# EAGLE board EEZ DIB MCU r1B3 (EAGLE 7.2.0), part 1 of 2
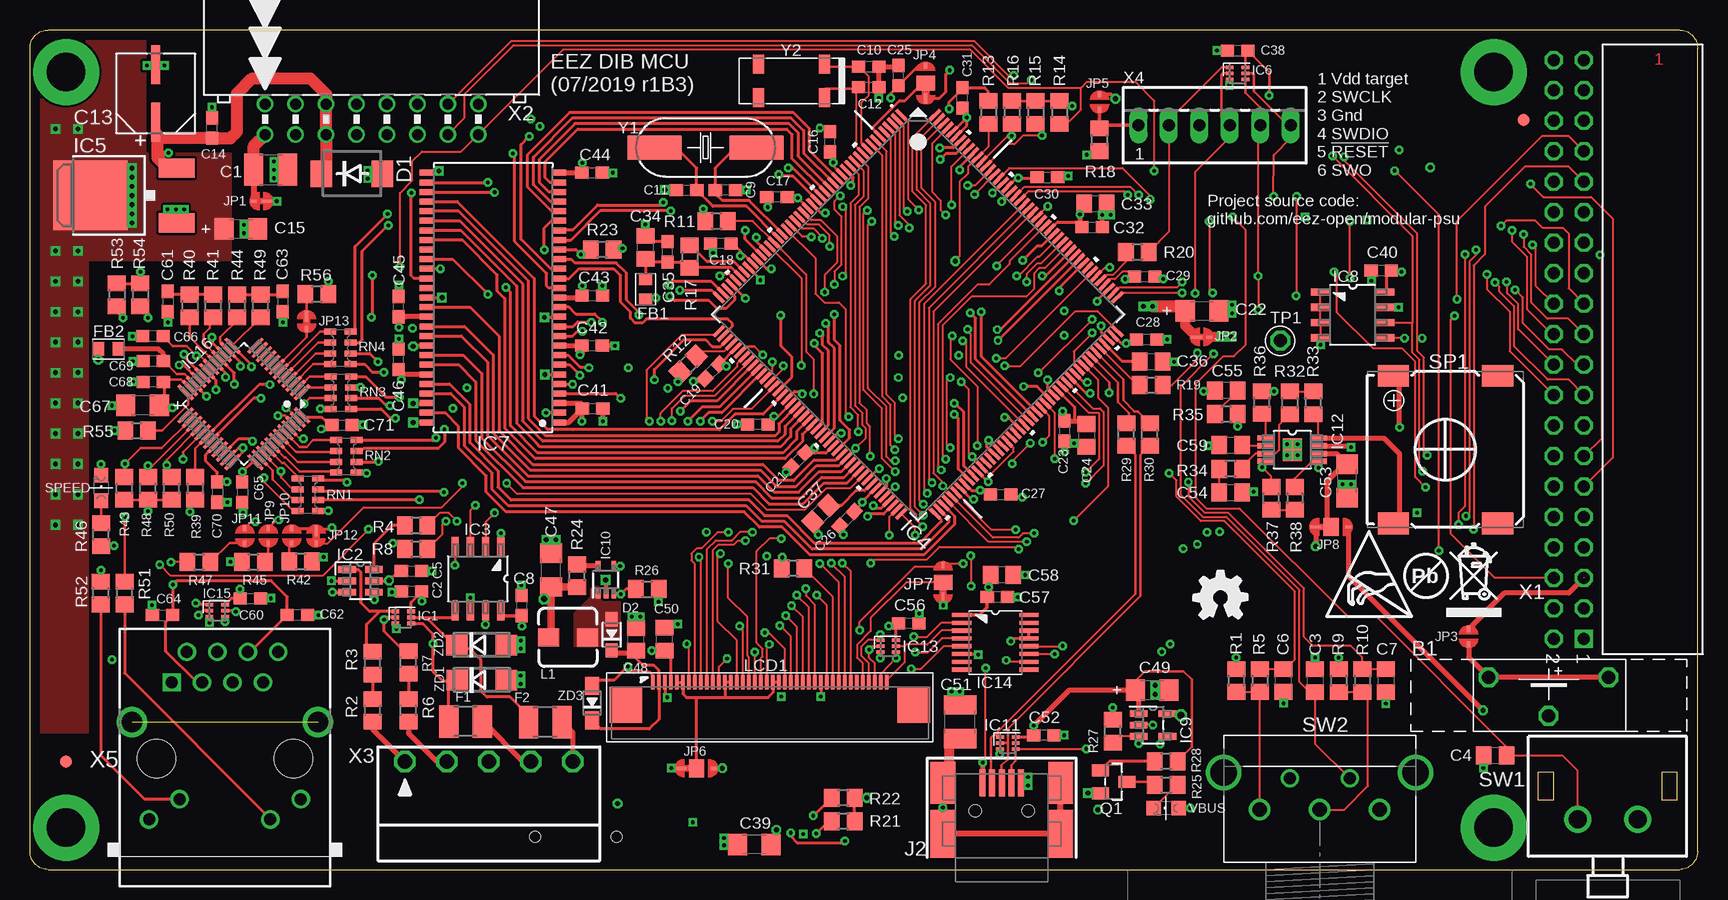
[diagram p5: board, top side]
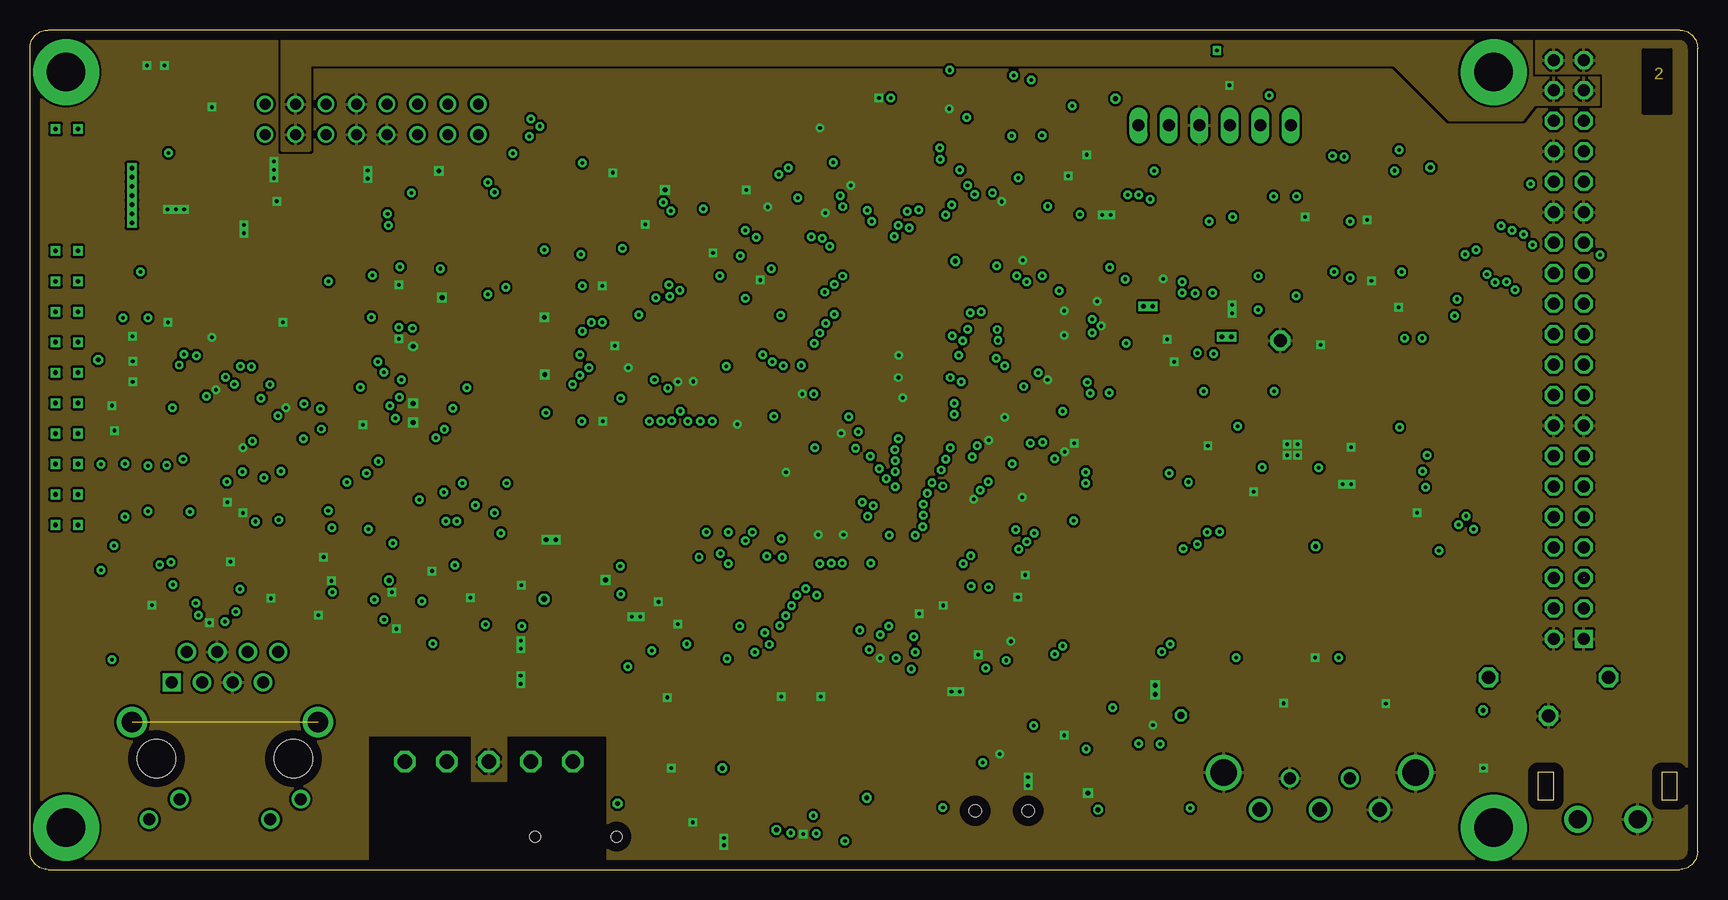
[diagram p6: board, inner layer Gnd]
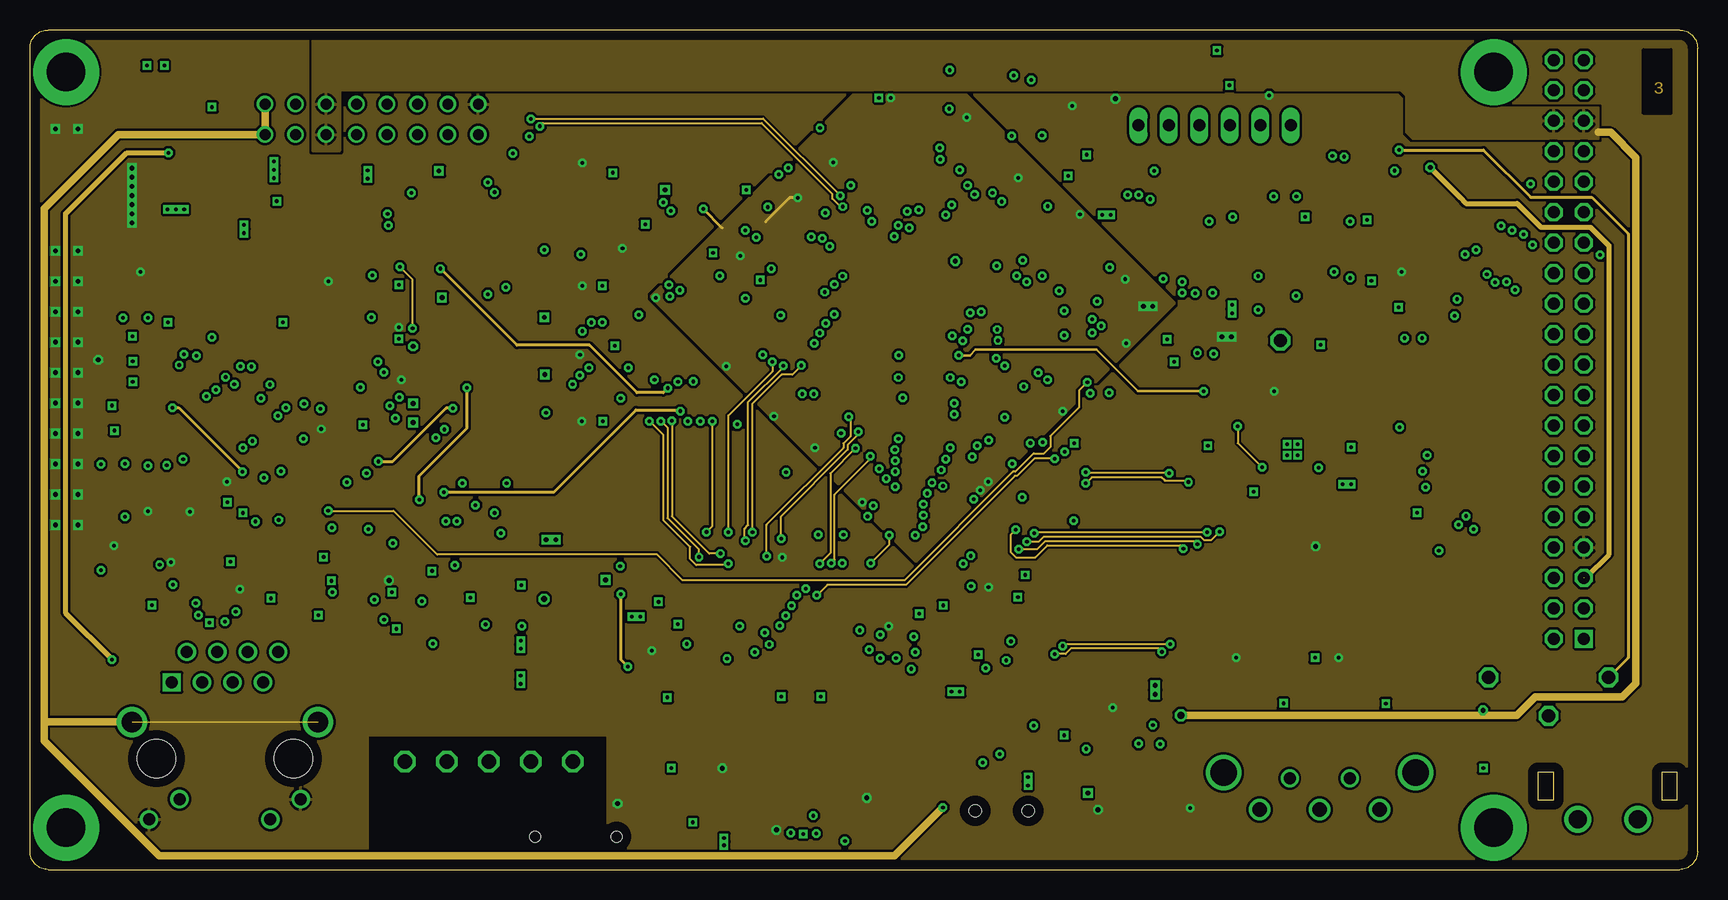
[diagram p7: board, inner layer Power]
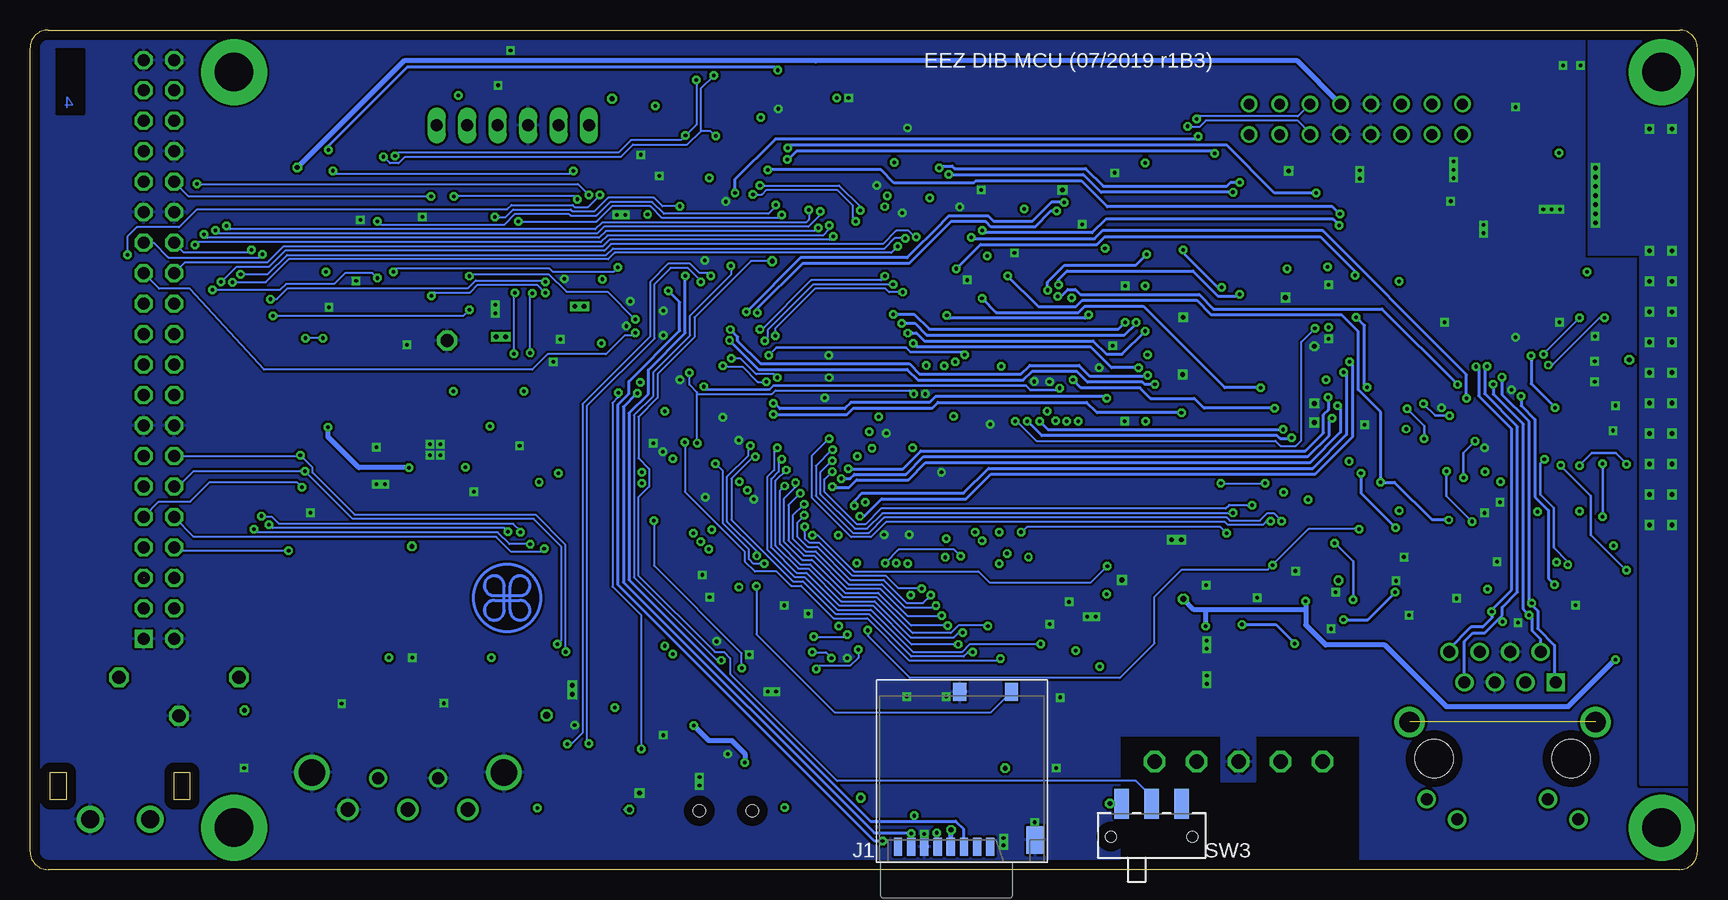
[diagram p8: board, bottom side, seen from below]

Size 139 x 70 mm. Coordinates in mm from the lower left corner, seen from the top.
Outline: 1.5,0 137.5,0 arc90 139,1.5 139,68.5 arc90 137.5,70 1.5,70 arc90 0,68.5 0,1.5 arc90 1.5,0
Copper layers (1+2+15+16): Top 0.035559375mm / dielectric 7mil / Gnd 0.03048125mm / dielectric 44mil / Power 0.03048125mm / dielectric 7mil / Bottom 0.035559375mm
Design rules "default *": minimum track width 6mil, minimum drill 0.3mm, track to track 4mil, track to pad 4mil, pad to pad 4mil, via to via 4mil, smd to smd 4mil, copper to edge 30mil, drill to drill 8mil, minimum pad ring 4mil, minimum via ring 8mil, stop-mask expansion 2.5mil, vias tented up to drill 0.6mm, thermal gap 8mil
Net classes: 0 default: width 0.152 mm, drill 0.3 mm, clearance 0.203 mm; 1 diff: width 0.229 mm, drill 0.3 mm, clearance 0.203 mm; 2 gnd: width 0.152 mm, drill 0.3 mm, clearance 0.203 mm

## Footprints (pad centres in the part's own frame; a part is rotated, then mirrored left to right if it is on the bottom)
S8401-46 = drill 1.1 octagon: 1 -5,0; 2 0,3.2; 3 5,0
C1210 = smd 1.6 x 2.7: 1 -1.4,0; 2 1.4,0
C0603 = smd 1.1 x 1: 1 -0.85,0; 2 0.85,0
C0805 = smd 1.3 x 1.5: 1 -0.95,0; 2 0.95,0
CAPAE660X610N = smd 3.251 x 0.762: 1 -2.413,0; 2 2.413,0
EC1206 = smd 1.6 x 1.8: + -1.4,0; - 1.4,0
C1206 = smd 1.6 x 1.8: 1 -1.4,0; 2 1.4,0
DO214AA = smd 1.8 x 2.2: A 2.55,0; C -2.55,0
SOD323-R = smd 1.2 x 1: A 1.3,0; C -1.3,0
F1210 = smd 1.6 x 2.7: 1 -1.4,0; 2 1.4,0
BEAD0603 = smd 1 x 1.1: P$1 -0.85,0; P$2 0.85,0
FIDUCIAL = smd 1.016 x 1.016: T 0,0
DRL6 = smd 0.654 x 0.301: 1 -0.65,0.5; 2 -0.65,0; 3 -0.65,-0.5; 4 0.65,-0.5; 5 0.65,0; 6 0.65,0.5
DBV6 = smd 1.473 x 0.559: 1 -1.118,0.95; 2 -1.118,0; 3 -1.118,-0.95; 4 1.118,-0.95; 5 1.118,0; 6 1.118,0.95
SOIC127P600X173-8N = smd 1.55 x 0.6: 1 -2.7,1.9; 2 -2.7,0.63; 3 -2.7,-0.64; 4 -2.7,-1.91; 5 2.7,-1.91; 6 2.7,-0.64; 7 2.7,0.63; 8 2.7,1.9
LQFP-176_24X24MM = smd 1.2 x 0.3: 1 -12.75,10.75; 2 -12.75,10.25; 3 -12.75,9.75; 4 -12.75,9.25; 5 -12.75,8.75; 6 -12.75,8.25; 7 -12.75,7.75; 8 -12.75,7.25; 9 -12.75,6.75; 10 -12.75,6.25; 11 -12.75,5.75; 12 -12.75,5.25; 13 -12.75,4.75; 14 -12.75,4.25; 15 -12.75,3.75; 16 -12.75,3.25; 17 -12.75,2.75; 18 -12.75,2.25; 19 -12.75,1.75; 20 -12.75,1.25; 21 -12.75,0.75; 22 -12.75,0.25; 23 -12.75,-0.25; 24 -12.75,-0.75; 25 -12.75,-1.25; 26 -12.75,-1.75; 27 -12.75,-2.25; 28 -12.75,-2.75; 29 -12.75,-3.25; 30 -12.75,-3.75; 31 -12.75,-4.25; 32 -12.75,-4.75; 33 -12.75,-5.25; 34 -12.75,-5.75; 35 -12.75,-6.25; 36 -12.75,-6.75; 37 -12.75,-7.25; 38 -12.75,-7.75; 39 -12.75,-8.25; 40 -12.75,-8.75; 41 -12.75,-9.25; 42 -12.75,-9.75; 43 -12.75,-10.25; 44 -12.75,-10.75; 89 12.75,-10.75; 90 12.75,-10.25; 91 12.75,-9.75; 92 12.75,-9.25; 93 12.75,-8.75; 94 12.75,-8.25; 95 12.75,-7.75; 96 12.75,-7.25; 97 12.75,-6.75; 98 12.75,-6.25; 99 12.75,-5.75; 100 12.75,-5.25; 101 12.75,-4.75; 102 12.75,-4.25; 103 12.75,-3.75; 104 12.75,-3.25; 105 12.75,-2.75; 106 12.75,-2.25; 107 12.75,-1.75; 108 12.75,-1.25; 109 12.75,-0.75; 110 12.75,-0.25; 111 12.75,0.25; 112 12.75,0.75; 113 12.75,1.25; 114 12.75,1.75; 115 12.75,2.25; 116 12.75,2.75; 117 12.75,3.25; 118 12.75,3.75; 119 12.75,4.25; 120 12.75,4.75; 121 12.75,5.25; 122 12.75,5.75; 123 12.75,6.25; 124 12.75,6.75; 125 12.75,7.25; 126 12.75,7.75; 127 12.75,8.25; 128 12.75,8.75; 129 12.75,9.25; 130 12.75,9.75; 131 12.75,10.25; 132 12.75,10.75 | smd 0.3 x 1.2: 45 -10.75,-12.75; 46 -10.25,-12.75; 47 -9.75,-12.75; 48 -9.25,-12.75; 49 -8.75,-12.75; 50 -8.25,-12.75; 51 -7.75,-12.75; 52 -7.25,-12.75; 53 -6.75,-12.75; 54 -6.25,-12.75; 55 -5.75,-12.75; 56 -5.25,-12.75; 57 -4.75,-12.75; 58 -4.25,-12.75; 59 -3.75,-12.75; 60 -3.25,-12.75; 61 -2.75,-12.75; 62 -2.25,-12.75; 63 -1.75,-12.75; 64 -1.25,-12.75; 65 -0.75,-12.75; 66 -0.25,-12.75; 67 0.25,-12.75; 68 0.75,-12.75; 69 1.25,-12.75; 70 1.75,-12.75; 71 2.25,-12.75; 72 2.75,-12.75; 73 3.25,-12.75; 74 3.75,-12.75; 75 4.25,-12.75; 76 4.75,-12.75; 77 5.25,-12.75; 78 5.75,-12.75; 79 6.25,-12.75; 80 6.75,-12.75; 81 7.25,-12.75; 82 7.75,-12.75; 83 8.25,-12.75; 84 8.75,-12.75; 85 9.25,-12.75; 86 9.75,-12.75; 87 10.25,-12.75; 88 10.75,-12.75; 133 10.75,12.75; 134 10.25,12.75; 135 9.75,12.75; 136 9.25,12.75; 137 8.75,12.75; 138 8.25,12.75; 139 7.75,12.75; 140 7.25,12.75; 141 6.75,12.75; 142 6.25,12.75; 143 5.75,12.75; 144 5.25,12.75; 145 4.75,12.75; 146 4.25,12.75; 147 3.75,12.75; 148 3.25,12.75; 149 2.75,12.75; 150 2.25,12.75; 151 1.75,12.75; 152 1.25,12.75; 153 0.75,12.75; 154 0.25,12.75; 155 -0.25,12.75; 156 -0.75,12.75; 157 -1.25,12.75; 158 -1.75,12.75; 159 -2.25,12.75; 160 -2.75,12.75; 161 -3.25,12.75; 162 -3.75,12.75; 163 -4.25,12.75; 164 -4.75,12.75; 165 -5.25,12.75; 166 -5.75,12.75; 167 -6.25,12.75; 168 -6.75,12.75; 169 -7.25,12.75; 170 -7.75,12.75; 171 -8.25,12.75; 172 -8.75,12.75; 173 -9.25,12.75; 174 -9.75,12.75; 175 -10.25,12.75; 176 -10.75,12.75
DPACK = smd 1.6 x 3: 1 -2.28,-4.8; 3 2.28,-4.8 | smd 5.8 x 6.2: 4 0,2.38
TSOPII-54 = smd 1.2 x 0.5: 1 -5.502,10.4; 2 -5.502,9.6; 3 -5.502,8.8; 4 -5.502,8; 5 -5.502,7.2; 6 -5.502,6.4; 7 -5.502,5.6; 8 -5.502,4.8; 9 -5.502,4; 10 -5.502,3.2; 11 -5.502,2.4; 12 -5.502,1.6; 13 -5.502,0.8; 14 -5.502,0; 15 -5.502,-0.8; 16 -5.502,-1.6; 17 -5.502,-2.4; 18 -5.502,-3.2; 19 -5.502,-4; 20 -5.502,-4.8; 21 -5.502,-5.6; 22 -5.502,-6.4; 23 -5.502,-7.2; 24 -5.502,-8; 25 -5.502,-8.8; 26 -5.502,-9.6; 27 -5.502,-10.4; 28 5.502,-10.4; 29 5.502,-9.6; 30 5.502,-8.8; 31 5.502,-8; 32 5.502,-7.2; 33 5.502,-6.4; 34 5.502,-5.6; 35 5.502,-4.8; 36 5.502,-4; 37 5.502,-3.2; 38 5.502,-2.4; 39 5.502,-1.6; 40 5.502,-0.8; 41 5.502,0; 42 5.502,0.8; 43 5.502,1.6; 44 5.502,2.4; 45 5.502,3.2; 46 5.502,4; 47 5.502,4.8; 48 5.502,5.6; 49 5.502,6.4; 50 5.502,7.2; 51 5.502,8; 52 5.502,8.8; 53 5.502,9.6; 54 5.502,10.4
DBV5 = smd 1.473 x 0.559: 1 -1.194,0.95; 2 -1.194,0; 3 -1.194,-0.95; 4 1.194,-0.95; 5 1.194,0.95
DCK5 = smd 0.85 x 0.4: 1 -1.125,0.65; 2 -1.125,0; 3 -1.125,-0.65; 4 1.125,-0.65; 5 1.125,0.65
SOP65P490X110-9N = smd 1.422 x 0.432: 1 -2.184,0.965; 2 -2.184,0.33; 3 -2.184,-0.33; 4 -2.184,-0.965; 5 2.184,-0.965; 6 2.184,-0.33; 7 2.184,0.33; 8 2.184,0.965 | smd 1.575 x 1.88: TP 0,0
PW(R-PDSO-G16) = smd 1.6 x 0.35: 1 -2.8,2.3; 2 -2.8,1.65; 3 -2.8,1; 4 -2.8,0.35; 5 -2.8,-0.3; 6 -2.8,-0.95; 7 -2.8,-1.6; 8 -2.8,-2.25; 9 2.8,-2.25; 10 2.8,-1.6; 11 2.8,-0.95; 12 2.8,-0.3; 13 2.8,0.35; 14 2.8,1; 15 2.8,1.65; 16 2.8,2.3
PT48 = smd 1.676 x 0.279: 1 -4.115,2.75; 2 -4.115,2.25; 3 -4.115,1.75; 4 -4.115,1.25; 5 -4.115,0.75; 6 -4.115,0.25; 7 -4.115,-0.25; 8 -4.115,-0.75; 9 -4.115,-1.25; 10 -4.115,-1.75; 11 -4.115,-2.25; 12 -4.115,-2.75; 25 4.115,-2.75; 26 4.115,-2.25; 27 4.115,-1.75; 28 4.115,-1.25; 29 4.115,-0.75; 30 4.115,-0.25; 31 4.115,0.25; 32 4.115,0.75; 33 4.115,1.25; 34 4.115,1.75; 35 4.115,2.25; 36 4.115,2.75 | smd 0.279 x 1.676: 13 -2.75,-4.115; 14 -2.25,-4.115; 15 -1.75,-4.115; 16 -1.25,-4.115; 17 -0.75,-4.115; 18 -0.25,-4.115; 19 0.25,-4.115; 20 0.75,-4.115; 21 1.25,-4.115; 22 1.75,-4.115; 23 2.25,-4.115; 24 2.75,-4.115; 37 2.75,4.115; 38 2.25,4.115; 39 1.75,4.115; 40 1.25,4.115; 41 0.75,4.115; 42 0.25,4.115; 43 -0.25,4.115; 44 -0.75,4.115; 45 -1.25,4.115; 46 -1.75,4.115; 47 -2.25,4.115; 48 -2.75,4.115
5033981892 = smd 0.7 x 1.5: 1 4.45,12.6; 2 5.55,12.6; 3 6.65,12.6; 4 7.75,12.6; 5 8.85,12.6; 6 9.95,12.6; 7 11.05,12.6; 8 12.15,12.6 | smd 1.45 x 2.33: S 0.7,12.04 | smd 1.1 x 1.5: SW1 2.7,-0.3; SW2 7,-0.3
678038020 = smd 2.25 x 0.5: 1 6.225,1.6; 2 6.225,0.8; 3 6.225,0; 4 6.225,-0.8; 5 6.225,-1.6 | smd 4 x 2.05: SH1 2,-4.9; SH2 2,4.9 | smd 3.5 x 2.05: SH1.1 6.25,-4.9; SH2.2 6.25,4.9 | hole 1: 3.9,2.2; 3.9,-2.2
JP2-NOCUT = smd 0.889 x 0.254: 1 -0.445,0 | smd 0.508 x 0.254: 2 0.635,0
JP2-CUT = smd 0.508 x 0.254: 1 -0.635,0; 2 0.635,0
JP3-CUT = smd 1.27 x 1.524: COM 0,0 | smd 0.889 x 0.254: NC -1.27,0 | smd 0.508 x 0.254: NO 1.46,0
DE0403 = smd 1.5 x 1.75: 1 0,1.626; 2 0,-1.625
FPC_40 = smd 0.3 x 1.2: 1 -9.75,1.9; 2 -9.25,1.9; 3 -8.75,1.9; 4 -8.25,1.9; 5 -7.75,1.9; 6 -7.25,1.9; 7 -6.75,1.9; 8 -6.25,1.9; 9 -5.75,1.9; 10 -5.25,1.9; 11 -4.75,1.9; 12 -4.25,1.9; 13 -3.75,1.9; 14 -3.25,1.9; 15 -2.75,1.9; 16 -2.25,1.9; 17 -1.75,1.9; 18 -1.25,1.9; 19 -0.75,1.9; 20 -0.25,1.9; 21 0.25,1.9; 22 0.75,1.9; 23 1.25,1.9; 24 1.75,1.9; 25 2.25,1.9; 26 2.75,1.9; 27 3.25,1.9; 28 3.75,1.9; 29 4.25,1.9; 30 4.75,1.9; 31 5.25,1.9; 32 5.75,1.9; 33 6.25,1.9; 34 6.75,1.9; 35 7.25,1.9; 36 7.75,1.9; 37 8.25,1.9; 38 8.75,1.9; 39 9.25,1.9; 40 9.75,1.9 | smd 2.7 x 3: Z1 -12,0; Z2 12,0
SOT23-BEC = smd 1 x 1.4: B -0.95,-1.1; C 0,1.1; E 0.95,-1.1
R0805 = smd 1.3 x 1.5: 1 -0.95,0; 2 0.95,0
CAY16 = smd 0.5 x 1: 1 -1.35,-0.85; 2 -0.45,-0.85; 3 0.45,-0.85; 4 1.35,-0.85; 5 1.35,0.85; 6 0.45,0.85; 7 -0.45,0.85; 8 -1.35,0.85
LD-BZEL-M1313 = smd 1.8 x 2.6: + -6.15,-4.35; - 6.15,-4.35; NC1 -6.15,4.35; NC2 6.15,4.35
LED_0805 = smd 1.2 x 1.2: A 0,-1.05; C 0,1.05
TL1100C = drill 1.5: 1 0,2.5; 2 0,-2.5
PEC16-2215F = drill 1.2: A 0,-5; B 0,0; C 0,5 | drill 1: D -2.6,-2.5; E -2.6,2.5 | drill 2.2: GND1 -3.1,8; GND2 -3.1,-8
JS102011SAQN = smd 1.2 x 2.5: 1 -2.5,0; 2 0,0; 3 2.5,0 | hole 0.9: 3.4,-2.75; -3.4,-2.75
PCB_SHIELD_TAB = drill 1.1 octagon: 1 0,0
ZL263-40DG = drill 1 pad 1.5 square: 1 48.26,2.54 | drill 1 pad 1.5 octagon: 2 48.26,0; 3 45.72,2.54; 4 45.72,0; 5 43.18,2.54; 6 43.18,0; 7 40.64,2.54; 8 40.64,0; 9 38.1,2.54; 10 38.1,0; 11 35.56,2.54; 12 35.56,0; 13 33.02,2.54; 14 33.02,0; 15 30.48,2.54; 16 30.48,0; 17 27.94,2.54; 18 27.94,0; 19 25.4,2.54; 20 25.4,0; 21 22.86,2.54; 22 22.86,0; 23 20.32,2.54; 24 20.32,0; 25 17.78,2.54; 26 17.78,0; 27 15.24,2.54; 28 15.24,0; 29 12.7,2.54; 30 12.7,0; 31 10.16,2.54; 32 10.16,0; 33 7.62,2.54; 34 7.62,0; 35 5.08,2.54; 36 5.08,0; 37 2.54,2.54; 38 2.54,0; 39 0,2.54; 40 0,0
ML16L = drill 0.914: 1 -8.89,-1.27; 2 -8.89,1.27; 3 -6.35,-1.27; 4 -6.35,1.27; 5 -3.81,-1.27; 6 -3.81,1.27; 7 -1.27,-1.27; 8 -1.27,1.27; 9 1.27,-1.27; 10 1.27,1.27; 11 3.81,-1.27; 12 3.81,1.27; 13 6.35,-1.27; 14 6.35,1.27; 15 8.89,-1.27; 16 8.89,1.27
MC1,5/5-G-3,5 = drill 1.2 octagon: 1 -7,0; 2 -3.5,0; 3 0,0; 4 3.5,0; 5 7,0
22-23-2061 = drill 1 long: 1 -6.35,0; 2 -3.81,0; 3 -1.27,0; 4 1.27,0; 5 3.81,0; 6 6.35,0
RJ45-TRAFO-LED = drill 1 pad 1.524 square: 1 -4.445,6.35 | drill 1 pad 1.524: 2 -3.175,8.89; 3 -1.905,6.35; 4 -0.635,8.89; 5 0.635,6.35; 6 1.905,8.89; 7 3.175,6.35; 8 4.445,8.89; 9 -6.325,-5.08; 10 -3.785,-3.38; 11 3.785,-5.08; 12 6.325,-3.38 | drill 1.7 pad 2.54: SH -7.75,3.05; SH2 7.75,3.05 | hole 3.2: -5.715,0; 5.715,0
HC-49/4H = smd 4.5 x 2: 1 -4.25,0; 2 4.25,0
85SMX = smd 0.9 x 1.6: 1 -2.75,-1.4; 4 -2.75,1.4; NC.2 2.75,-1.4; NC.3 2.75,1.4
DO214AC = smd 1.8 x 1.7: A 2.05,0; C -2.05,0
SOD323-W = smd 1.5 x 1.2: A 1.45,0; C -1.45,0

## Placement (x,y rotation side)
B1  S8401-46 or DS1092-16-B6P  [S8401-46]  126.59,16.01 180 top
C1  N.C.  [C1210]  20.06,58.36 0 top
C2  100n  [C0603]  31.8,23.18 180 top
C3  10n  [C0805]  107.12,15.75 270 top
C4  10n  [C0805]  122.13,9.51 0 top
C5  100n  [C0603]  31.8,24.89 0 top
C6  10n  [C0805]  104.49,15.76 90 top
C7  10n  [C0805]  113.02,15.75 270 top
C8  100n  [C0603]  40.96,22.01 270 top
C9  18p  [C0603]  57.97,56.64 180 top
C10  4p7  [C0603]  69.92,66.95 0 top
C11  18p  [C0603]  54.73,56.64 0 top
C12  4p7  [C0603]  69.92,65.23 0 top
C13  EEEFK1V470P  [CAPAE660X610N]  10.47,64.71 90 top
C14  100n  [C0603]  15.17,61.82 90 top
C15  4u7  [EC1206]  17.58,53.42 0 top
C16  100n  [C0603]  66.7,60.68 90 top
C17  100n  [C0603]  62.27,56.07 180 top
C18  100n  [C0603]  57.59,52.2 180 top
C19  100n  [C0603]  56.86,41.54 225 top
C20  100n  [C0603]  60.66,37.11 180 top
C21  100n  [C0603]  64.05,34.15 225 top
C22  4u7  [EC1206]  97.69,46.58 0 top
C23  100n  [C0603]  86.22,36.56 270 top
C24  1u  [C0805]  88.07,36.2 270 top
C25  N.C.  [C0603]  72.39,66.19 90 top
C26  100n  [C0603]  68.1,29.26 225 top
C27  100n  [C0603]  80.92,31.27 0 top
C28  100n  [C0603]  93.08,44.2 0 top
C29  100n  [C0603]  92.92,49.43 0 top
C30  100n  [C0603]  84.81,57.71 0 top
C31  100n  [C0603]  77.72,64.34 90 top
C32  100n  [C0603]  88.55,53.54 0 top
C33  1u  [C0805]  88.82,55.51 0 top
C34  1u  [C0805]  51.31,51.88 90 top
C35  100n  [C0603]  53.14,51.5 90 top
C36  2u2  [C0805]  93.46,42.35 0 top
C37  2u2  [C0805]  65.92,29.68 225 top
C38  100n  [C0603]  100.66,68.26 180 top
C39  4u7  [C1206]  60.38,2.08 180 top
C40  100n  [C0603]  112.64,49.95 0 top
C41  100n  [C0603]  46.89,38.44 0 top
C42  100n  [C0603]  46.85,43.69 0 top
C43  100n  [C0603]  46.87,47.84 0 top
C44  100n  [C0603]  46.85,58.1 0 top
C45  100n  [C0603]  30.74,46.94 90 top
C46  100n  [C0603]  30.74,42.55 90 top
C47  4u7  [C1206]  43.44,24.97 90 top
C48  1u  [C0805]  50.52,19.19 90 top
C49  4u7  [EC1206]  93.54,14.97 0 top
C50  2u2  [C0805]  52.9,19.2 90 top
C51  N.C.  [C1210]  77.53,12.32 90 top
C52  100n  [C0603]  84.51,11.2 180 top
C53  4u7  [C1206]  109.8,32.4 90 top
C54  470n  [C0805]  100.08,31.45 0 top
C55  470n  [C0805]  99.72,39.93 180 top
C56  100n  [C0603]  73.26,20.54 180 top
C57  100n  [C0603]  80.64,22.72 180 top
C58  1u  [C0805]  81.02,24.56 180 top
C59  N.C.  [C0805]  100.08,35.38 0 top
C60  100n  [C0603]  18.38,22.61 0 top
C61  100n  [C0603]  11.48,47.36 270 top
C62  100n  [C0603]  22.29,21.21 180 top
C63  100n  [C0603]  21.06,47.36 270 top
C64  100n  [C0603]  11.05,21.21 0 top
C65  100n  [C0603]  17.71,31.46 270 top
C66  100n  [C0603]  10.25,44.46 180 top
C67  10u  [EC1206]  9.39,38.7 180 top
C68  100n  [C0603]  10.28,40.67 180 top
C69  100n  [C0603]  10.28,42.38 180 top
C70  100n  [C0603]  15.61,31.47 270 top
C71  100n  [C0603]  26.01,37.06 0 top
D1  SMBJ5.0A-TR  [DO214AA]  26.84,58.01 0 top
D2  RB751V40T1G  [SOD323-R]  48.49,19.57 90 top
EEZ_SIGNATURE  SIGNATURESMALL  [SIGNATURE_5MM]  99.22,22.64 180 top
F1  50mA  [F1210]  36.31,12.34 180 top
F2  50mA  [F1210]  42.96,12.29 180 top
FB1  BLM18AG102SH1D  [BEAD0603]  51.31,48.37 90 top
FB2  BLM18AG102SH1D  [BEAD0603]  6.53,43.41 0 top
FM1  FIDUCIAL  [FIDUCIAL]  3,9 0 top
FM2  FIDUCIAL  [FIDUCIAL]  124.5,62.5 0 top
IC1  TPD4E001DRLR  [DRL6]  31.11,21.02 0 top
IC2  SN74LVC2G34DBVR  [DBV6]  27.55,24.07 0 top
IC3  BTS3408G  [SOIC127P600X173-8N]  37.34,24.24 270 top
IC4  STM32F769IGT6  [LQFP-176_24X24MM]  74.03,46.29 315 top
IC5  LD1117ADT33TR  [DPACK]  7.42,56.2 90 top
IC6  TPD4E001DRLR  [DRL6]  100.65,66.38 0 top
IC7  IS42S16400J  [TSOPII-54]  38.6,47.69 180 top
IC8  AT24C256C-SSHL-B  [SOIC127P600X173-8N]  110.27,46.24 0 top
IC9  TPS2051BDBVR  [DBV5]  93.62,12.05 0 top
IC10  TPS61169DCKR  [DCK5]  48.01,24.17 90 top
IC11  TPD4E001DRLR  [DRL6]  81.51,10.55 0 top
IC12  TPA6205A1DGN  [SOP65P490X110-9N]  105.22,35 0 top
IC13  TPD4E001DRLR  [DRL6]  71.54,18.63 0 top
IC14  TSC2007IPW  [PW(R-PDSO-G16)]  80.47,18.92 0 top
IC15  TPD4E001DRLR  [DRL6]  15.61,21.59 0 top
IC16  DP83848CVV/NOPB  [PT48]  17.84,38.82 225 top
J1  503398-1892  [5033981892]  54.5,14.5 180 bottom
J2  67803-8020  [678038020]  81,1 90 top
JP1  JP2-NOCUT  [JP2-NOCUT]  19.3,55.73 180 top
JP2  JP2-NOCUT  [JP2-NOCUT]  97.67,44.41 0 top
JP3  JP2-CUT  [JP2-CUT]  119.92,19.42 90 top
JP4  JP3-CUT  [JP3-CUT]  74.67,65.57 90 top
JP5  JP2-CUT  [JP2-CUT]  89.16,64 270 top
JP6  JP3-CUT  [JP3-CUT]  55.55,8.45 0 top
JP7  JP3-CUT  [JP3-CUT]  76.12,23.94 90 top
JP8  JP3-CUT  [JP3-CUT]  108.45,28.56 0 top
JP9  JP2-CUT  [JP2-CUT]  19.87,27.81 270 top
JP10  JP2-CUT  [JP2-CUT]  21.82,27.81 270 top
JP11  JP2-CUT  [JP2-CUT]  17.91,27.81 90 top
JP12  JP2-NOCUT  [JP2-NOCUT]  23.84,27.81 270 top
JP13  JP2-NOCUT  [JP2-NOCUT]  23.05,45.69 270 top
L1  DLG-0403-4R7  [DE0403]  44.84,19.37 90 top
LCD1  505110-4091  [FPC_40]  61.68,13.72 0 top
Q1  MMBT5551  [SOT23-BEC]  90.33,7.32 270 top
R1  4K7  [R0805]  100.55,15.76 270 top
R2  4K7  [R0805]  28.57,13.27 90 top
R3  4K7  [R0805]  28.57,17.21 90 top
R4  1K  [R0805]  32.19,28.7 0 top
R5  10K  [R0805]  102.52,15.76 270 top
R6  4K7  [R0805]  31.55,13.27 90 top
R7  4K7  [R0805]  31.55,17.27 90 top
R8  1K  [R0805]  32.19,26.73 0 top
R9  4K7  [R0805]  109.08,15.75 270 top
R10  10K  [R0805]  111.05,15.75 270 top
R11  10K  [R0805]  57.23,54.08 0 top
R12  10K  [R0805]  54.87,42.15 45 top
R13  10K  [R0805]  79.89,63.12 270 top
R14  4K7  [R0805]  85.81,63.12 270 top
R15  4K7  [R0805]  83.82,63.12 270 top
R16  4K7  [R0805]  81.86,63.12 270 top
R17  47R  [R0805]  55,51.1 270 top
R18  10K  [R0805]  89.16,60.85 90 top
R19  22R  [R0805]  93.46,40.39 0 top
R20  22R  [R0805]  92.31,51.5 0 top
R21  47K  [R0805]  67.78,4.01 180 top
R22  47K  [R0805]  67.78,5.97 180 top
R23  N.C.  [R0805]  47.69,51.69 180 top
R24  10R  [R0805]  45.61,24.49 90 top
R25  330R  [R0805]  94.71,7.06 0 top
R26  10R  [R0805]  51.45,23.38 0 top
R27  N.C.  [R0805]  90.25,11.54 90 top
R28  47K  [R0805]  94.71,9.03 180 top
R29  22R  [R0805]  91.38,36.27 90 top
R30  22R  [R0805]  93.34,36.27 90 top
R31  10K  [R0805]  63.61,25.11 180 top
R32  10K  [R0805]  105.01,38.91 270 top
R33  10K  [R0805]  106.99,38.91 90 top
R34  10K  [R0805]  100.08,33.41 180 top
R35  10K  [R0805]  99.72,37.96 180 top
R36  47K  [R0805]  102.68,38.94 90 top
R37  10K  [R0805]  103.46,30.95 90 top
R38  10K  [R0805]  105.43,30.95 270 top
R39  1K5  [R0805]  13.77,31.78 270 top
R40  49R9  [R0805]  13.33,46.99 270 top
R41  49R9  [R0805]  15.28,46.99 90 top
R42  2K2  [R0805]  22.56,25.67 180 top
R43  2K2  [R0805]  7.87,31.78 90 top
R44  49R9  [R0805]  17.25,46.99 270 top
R45  2K2  [R0805]  18.62,25.65 0 top
R46  220R  [R0805]  5.92,27.91 90 top
R47  2K2  [R0805]  14.08,25.64 0 top
R48  2K2  [R0805]  9.83,31.78 90 top
R49  49R9  [R0805]  19.22,46.99 90 top
R50  2K2  [R0805]  11.8,31.78 90 top
R51  220R  [R0805]  7.89,23.05 90 top
R52  220R  [R0805]  5.91,23.05 90 top
R53  2K2  [R0805]  7.24,47.92 270 top
R54  2K2  [R0805]  9.2,47.92 270 top
R55  4K87  [R0805]  8.89,36.6 0 top
R56  2K2  [R0805]  23.92,47.97 180 top
RN1  DR1206-33R-4/8  [CAY16]  23.17,31.24 90 top
RN2  DR1206-33R-4/8  [CAY16]  26.38,34.44 90 top
RN3  DR1206-33R-4/8  [CAY16]  25.91,39.75 90 top
RN4  DR1206-33R-4/8  [CAY16]  25.89,43.48 90 top
SP1  LD-BZEL-M1313  [LD-BZEL-M1313]  117.99,35 270 top
SPEED  LTST-C170YKT  [LED_0805]  5.94,31.81 0 top
SW1  TL1100CF160Q  [TL1100C]  131.5,4.2 90 top
SW2  PEC16-2215F-S0024  [PEC16-2215F]  107.5,5 270 top
SW3  JS102011SAQN  [JS102011SAQN]  45.5,5.5 0 bottom
TP1  [PCB_SHIELD_TAB]  104.22,44.09 0 top
U$1  [RECYCLE_BIN1/8]  118.05,21.06 0 top
U$5  [PB_SMALL]  116.37,24.48 180 top
U$6  [ESD_SYMBOL]  108.07,21.09 0 top
VBUS  HSMG-C170  [LED_0805]  94.71,5.12 90 top
X1  ZL263-40DG  [ZL263-40DG]  127,67.5 270 top
X2  ZL231-16KG  [ML16L]  28.48,62.56 0 top
X3  1844249  [MC1,5/5-G-3,5]  38.25,9 0 top
X4  22-23-2061  [22-23-2061]  98.75,62.05 0 top
X5  LMJTAB881243M-L  [RJ45-TRAFO-LED]  16.25,9.25 0 top
Y1  25MHz  [HC-49/4H]  56.32,60.2 0 top
Y2  XTAL016178-85SMX  [85SMX]  63.49,65.75 180 top
ZD1  SMAJ18A  [DO214AC]  37.66,15.8 0 top
ZD2  SMAJ18A  [DO214AC]  37.65,18.72 0 top
ZD3  BZX384-B30.115  [SOD323-W]  46.85,13.88 90 top

## Tracks (layer width: path | path; a pad name or v marks a point on that pad's centre or on a via)
!AUDIO_SHDN
  Top 0.152: IC12.1 103.04,37.63 R36.1
!FAULT  (via drill 0.3)
  Top 0.152: IC4.58 60.13,38.41 58.6,38.41 57.59,37.39 v56.86,37.39 | v30.84,50.24 30.84,56.41 31.87,57.44 31.87,59.05 32.68,59.87 35.95,59.87 X2.15 44.46,68.38 78.34,68.38 81.51,65.21 87.62,65.21 | R14.2 86.43,62.17 87.62,63.36 87.62,65.21 | v117.44,26.58 117.44,54.59 v113.76,58.27 | 87.62,65.21 87.63,65.21 88.1,65.68 92.13,65.68 93.69,64.12 93.69,58.28 v93.72,58.26
  Top 0.254: v39.25,28.04 IC3.1
  Power 0.152: v56.86,37.39 56.86,28.61 v56.39,28.14 | v30.84,50.24 31.89,49.19 v31.89,45.12
  Bottom 0.152: v56.39,28.14 56.32,28.14 55.87,28.59 39.79,28.59 v39.25,28.04 | v56.86,37.39 56.76,37.39 55.11,35.74 35.18,35.74 34.76,35.32 33.48,35.32 33.04,35.76 33.04,43.98 v31.89,45.12 | v113.76,58.27 113.76,58.26 113.54,58.04 93.93,58.04 v93.72,58.26 | v117.44,26.58 126.72,26.58 X1.8
!RESET  (via drill 0.3)
  Top 0.152: R11.2 60.24,54.08 IC4.31 64.7,49.62 64.7,43.18 65.35,42.53 v65.35,39.65 | v28.22,28.38 28.22,28.35 24.38,24.5 11.74,24.5 v10.81,25.43 | v81.87,33.83 81.87,34.04 v83.39,35.56 | v88.55,45.87 84.1,41.43 v84.04,41.43 | v69.16,19.94 69.16,20.64 73.79,25.27 75.99,25.27 JP7.NO 76.2,25.49 v77.78,25.49 | v102.39,46.66 v102.39,49.48 102.39,61.89 X4.5 | X1.6 122.09,24.32 118.44,27.96 118.44,45.87 v118.75,46.18 | IC3.4 35.43,25.86 v35.42,25.39
  Top 0.203: IC16.29 12.77,34.82 v12.77,34.2 | IC6.4 101.3,64.78 102.51,63.58 102.51,62.1 X4.5
  Top 0.254: IC3.4
  Bottom 0.152: v65.35,39.65 65.65,39.95 76.85,39.95 77.18,39.62 83.37,39.62 83.39,39.6 | v83.39,35.56 83.39,39.6 | 83.39,39.6 83.39,39.79 84.03,40.42 84.03,41.41 v84.04,41.43 | v77.78,25.49 78.68,25.49 79.07,25.88 79.07,26.68 81.25,28.85 81.25,33.21 v81.87,33.83 | v69.16,19.94 69.16,19.48 65.65,15.98 48.15,15.98 45.27,18.86 45.27,22.73 42.98,25.02 35.79,25.02 v35.42,25.39 32.43,28.38 v28.22,28.38 | v118.75,46.18 102.87,46.18 v102.39,46.66 | v88.55,45.87 90.85,48.17 94.29,48.17 95.76,49.64 102.24,49.64 v102.39,49.48
  Bottom 0.203: v12.77,34.2 13.11,33.86 13.11,31.25 11.99,30.14 11.99,26.84 10.81,25.65 v10.81,25.43
!USB_OTG_FS_OC  (via drill 0.3)
  Top 0.152: v83.08,48.98 83.08,49.64 83.98,50.55 84.29,50.55 IC4.146 | v92.41,10.49 IC9.3 90.76,11.1 R27.1
  Bottom 0.152: v83.08,48.98 83.08,49.07 84.15,50.15 85.61,50.15 86.94,48.83 86.94,44.28 92.59,38.63 92.59,10.67 v92.41,10.49
+3V3  (via drill 0.3, 0.4)
  Top 0.152: R1.1 v100.55,17.67 | R9.1 v109.08,17.65 | R47.1 v11.74,25.64 | R36.2 v103.7,39.89 | 72.19,20.41 71.68,20.41 v71.57,20.3 | R31.2 62.66,25.97 v62.7,26.02 | C46.1 30.94,41.7 30.95,41.68 | R46.1 5.95,26.99
  Top 0.203: R43.1 R48.1 | R48.1 R50.1 | R48.1 v9.83,29.87 | 5.95,26.99 v6.99,26.99 | R54.1 v9.2,49.82 | v5.68,42.49 FB2.P$1 | v24.88,49.03 24.89,47.99 R56.1 | R16.1 R15.1 R14.1 86.22,63.65 v86.89,63.65 | v103.29,64.55 103.29,66.48 C38.1 | 101.3,68.05 IC6.6 | VBUS.A v96.72,5.12
  Top 0.254: R53.1 R54.1 | v49.4,51.78 R23.1 | IC13.6 72.19,20.32 C56.2 72.19,20.32 72.19,20.41 | IC16.32 14.66,34.59 14.66,34.06 15.61,33.11 C70.1 v16.41,32.32 | v30.75,45.21 30.75,46.08 C45.1 | v17.51,23.38 17.51,22.54 C60.1 16.78,22.61 IC15.6 | v13.33,29.83 13.33,30.38 R39.2 | v24.27,36.73 24.83,36.73 C71.1 24.97,37.06 24.34,37.69 22.85,37.69 IC16.48 | IC2.5 29.89,24.07 v29.93,24.11 30.71,24.89 C5.1 | 45.87,47.69 C43.1 | C58.2 79.92,24.09 v79.9,23.55 79.9,22.83 C57.2 | v51.85,18.25 C50.1 53.42,17.73 LCD1.4 | 113.47,49.59 C40.2 113.12,49.62 113.12,48.17 113.13,48.14 IC8.8 | R21.1 R22.1 | C39.1 61.78,2.31 62.25,2.78 62.25,3.27 v62.22,3.3 | JP6.NO v57.71,8.45
  Top 0.305: 101.3,68.05 C38.1 | IC14.1 79.14,21.22 79.79,21.87 C57.2 | C40.2 114.28,49.95 v114.33,49.84 | JP5.1 90.12,64.63 v90.48,64.28 | v69.75,5.98 68.75,5.98 R22.1
  Top 0.406: IC7.3 45.98,38.89 C41.1 | v46.03,48.67 46.03,47.71 C43.1 | v45.85,42.93 46.01,42.95 C42.1 IC7.9 | v46.03,58.93 46.01,58.9 C44.1 45.99,58.09 IC7.27 | IC7.43 31.33,46.09 C45.1 | IC7.49 31.16,41.29 C46.1 | 30.95,41.68 v30.95,40.82 | IC7.14 45.87,47.69 | v46.02,37.38 46.02,38.42 C41.1 | IC7.1 44.89,37.29 C41.1 | v90.25,13.49 R27.2 | JP8.NC 107.18,26.96 v107.17,26.95
  Top 0.813: v99.36,44.41 JP2.2
  Bottom 0.152: 89.49,4.99 v89.03,4.99
  Bottom 0.305: SW3.1 48.96,5.5 v48.98,5.5
  Bottom 0.406: J1.4 62.25,3.27 v62.22,3.3
  other vias: 8.5,56.2 8.5,56.96 8.5,57.72 8.5,55.44 8.5,54.67 8.5,53.91 8.5,58.48 2.13,51.59 2.13,49.05 2.13,46.51 2.13,43.97 2.13,41.43 2.13,38.89 3.99,51.59 3.99,49.05 3.99,46.51 3.99,43.97 3.99,41.43 3.99,38.89 3.99,36.35 3.99,33.81 2.13,36.35 2.13,33.81 3.99,31.27 3.99,28.73 2.13,31.27 2.13,28.73 3.99,61.75 2.13,61.75 100.14,44.41
  pour Power (isolate 0.203, rank 4): -0.07,69.34 139.12,69.85 139.12,0.76 48.19,0.76 48.19,11.18 28.12,11.18 28.12,0.25 -0.07,0.25
  pour Top (isolate 0.203, no thermals): -0.33,70.1 9.58,70.1 9.58,59.69 16.69,59.69 16.69,50.8 4.75,50.8 4.75,11.43 -0.33,11.43
  pour Bottom (isolate 0.203, no thermals): -0.33,70.1 9.07,70.1 9.07,51.31 4.75,51.31 4.75,7.11 -0.33,7.11
+3V3(A)  (via drill 0.3)
  Top 0.203: IC16.22 12.88,41.3 12.25,41.3 11.17,42.38
  Top 0.254: 11.17,42.38 C69.1 | v14.7,39.47 14.7,39.49 IC16.22 | X5.3 13.93,15.6 11.33,18.2 11.33,20.64 C64.2 v11.9,23.76 12.22,24.08 20.11,24.08 21.44,22.75 C62.2 18.37,18.14 X5.6
  Top 0.406: C69.1 11.13,42.97 10.7,43.4 8.37,43.4 FB2.P$2
  Bottom 0.254: v14.7,39.47 14.7,38.68 13.55,37.54 13.55,31.08 12.43,29.95 12.43,24.28 v11.9,23.76
+5V  (via drill 0.3, 0.4, 0.5, 0.6)
  Top 0.254: C13.1 10.47,61.4 10.6,61.28 | IC1.6 31.76,22.28 C2.1
  Top 0.305: IC3.8 39.3,21.6 | 39.3,21.6 39.3,21.65 | 39.3,21.6 39.3,21.16 C8.2
  Top 0.406: C2.1 v32.66,22.39 | v11.55,59.77 11.29,59.77 10.75,59.22 | IC9.5 95.84,13 v95.94,12.87 | C8.2 41,21.12 v41,20.3 | JP8.NO 109.91,24.49 v121.12,13.27
  Top 0.61: C47.1 43.44,19.37 L1.1 | R24.1 45.61,23.57 C47.1 | v42.85,22.54 42.85,23.57 C47.1
  Top 1.016: 10.6,61.28 10.62,61.25 10.62,61.23 | 10.62,61.23 10.62,59.35 10.75,59.22 11.48,58.48 IC5.3 | 10.62,61.23 10.87,60.97 C14.1 16.71,60.97 17.26,61.53 17.26,64.71 18.53,65.98 23.36,65.98 24.69,64.64 24.69,63.85 X2.6 X2.5 24.67,58.4 D1.C
  Power 0.406: v11.55,59.77 8.07,59.77 2.95,54.65 2.95,21.4 v6.85,17.5
  Power 0.61: 130.74,61.47 131.75,61.47 133.88,59.35 133.88,15.51 132.75,14.38 125.47,14.38 123.96,12.87 121.16,12.87 | v95.94,12.87 121.16,12.87 | v121.12,13.27 121.12,12.9 121.16,12.87
  Bottom 0.406: v32.66,22.39 32.66,21.67 | 32.66,21.67 32.66,20.39 30.98,18.72 26.08,18.72 20.95,13.59 10.76,13.59 v6.85,17.5 | 32.66,21.67 32.67,21.65 41.01,21.65 | 41.01,21.65 41.97,21.65 v42.85,22.54 | v41,20.3 41,21.64 41.01,21.65
  pour Power (isolate 0.203): 23.55,59.94 25.84,59.94 25.84,65.02 114.23,65.02 114.74,64.52 114.74,61.47 115.24,60.96 130.74,60.96 130.74,63.5 121.85,63.5 121.85,69.6 23.55,69.09
+12V
  pour Gnd (isolate 0.203): 23.3,59.94 21.01,59.94 21.01,70.1 125.15,70.1 125.15,66.04 130.74,66.04 130.74,63.75 125.4,63.75 124.39,62.48 118.29,62.48 113.72,67.06 23.3,67.06
+VAUX  (via drill 0.4)  (1 unrouted)
  Top 0.406: JP3.2 122.92,23.05 128.27,23.05 X1.5
  Power 0.406: 129.54,24.34 129.7,24.34 131.64,26.28 131.64,51.99 130.08,53.56 125.95,53.56 123.97,55.54 119.7,55.54 119.18,56.06 v116.72,58.53
  Bottom 0.305: 73.51,67.4 73.49,67.42
  Bottom 0.406: X2.10 33.35,67.42 73.49,67.42 107.81,67.42 v116.72,58.53
BOOT0  (via drill 0.4)
  Top 0.152: R13.2 79.89,60.28 IC4.166 78.2,58.59 78.2,58.04 77.5,57.34 77.5,51.1 v77.13,50.74
  Bottom 0.152: v77.13,50.74 78.91,50.74 83.61,46.04 83.61,44.39 86.67,41.33 86.67,39.34 88.28,37.73 88.28,34.3 87.38,33.4 87.38,31.93 88.3,31.01 88.3,24.52 81.91,18.14 81.16,18.14 80.64,17.61 80.64,16.31 71.71,7.38 46.83,7.38 45.5,6.04 SW3.2
BYPASS_REG
  Top 0.152: IC4.48 57.85,43.19 55.91,43.19 R12.2
DAC_OUT1  (via drill 0.3)
  Top 0.152: v97.83,39.88 98.72,39.88 C55.2
  Top 0.203: IC4.50 59.67,43.6 60.39,43.6 v61.08,42.91
  Power 0.203: v77.42,42.86 78.34,42.86 78.82,43.34 88.89,43.34 92.35,39.89 v97.82,39.89 v97.83,39.88
  Bottom 0.203: v61.08,42.91 61.31,43.14 65.59,43.14 65.97,43.52 76.76,43.52 v77.42,42.86
DIN1  (via drill 0.3)
  Top 0.152: v35.59,29.03 35.59,29.05 34.9,29.73 34.16,29.73 R4.2 | v72.39,35.93 v72.38,35.93 72.1,36.21 72.1,38.9 71.4,39.6 71.4,59.88 IC4.7
  Bottom 0.152: v35.59,29.03 35.96,29.03 36.25,28.74 39.15,28.74 39.4,28.99 67.64,28.99 68.91,27.72 70.55,27.72 73.84,31.01 73.84,34.48 v72.39,35.93
DIN2  (via drill 0.3)
  Top 0.152: v34.67,29.06 34.34,28.73 34.34,27.94 R8.2 | v72.1,35.01 71.75,35.37 71.75,38.75 71.05,39.45 71.05,59.53 IC4.8
  Bottom 0.152: v34.67,29.06 35.28,29.67 35.91,29.67 36.48,29.1 38.99,29.1 39.25,29.35 67.8,29.35 69.07,28.08 70.4,28.08 73.49,31.17 73.49,33.66 72.13,35.01 v72.1,35.01
DOUT1  (via drill 0.3)
  Top 0.152: v72.13,34.1 71.72,34.1 71.39,34.43 71.39,38.59 69.87,40.12 69.87,53.76 v70.16,54.05 | v38.73,29.73 37.97,28.98 IC3.2 | IC4.162 v78.72,56.29 v78.73,56.29
  Bottom 0.152: v38.73,29.73 38.75,29.7 67.95,29.7 69.22,28.43 70.25,28.43 73.13,31.32 73.13,33.1 v72.13,34.1 | v78.73,56.29 78,56.29 77.6,56.68 71.72,56.68 70.43,55.38 70.43,54.32 v70.16,54.05
DOUT2  (via drill 0.3)
  Top 0.152: v72.11,33.19 71.03,34.27 71.03,38.44 69.5,39.98 69.5,54.67 v69.79,54.97 | v37.14,30.39 36.7,29.95 IC3.3 | IC4.163 78.77,57.04 v78.15,57.04
  Bottom 0.152: v72.11,33.19 72.78,32.52 72.78,31.48 70.08,28.79 69.37,28.79 68.08,30.09 39.35,30.09 39.03,30.4 37.15,30.4 v37.14,30.39 | v78.15,57.04 71.56,57.04 69.79,55.27 v69.79,54.97
ENC_A  (via drill 0.3)
  Top 0.152: R5.1 C6.2 104.61,16.71 105.44,17.54 105.44,23.18 99.56,29.06 97.6,29.06 95.57,31.09 95.57,32.45 v94.96,33.06 | IC4.119 88.25,38.09 89.04,38.09 89.11,38.02 89.11,34.23 v88.02,33.13
  Power 0.152: v94.96,33.06 88.12,33.06 v88.02,33.13
ENC_B  (via drill 0.3)
  Top 0.152: C7.1 R10.1 111.05,17.7 110.11,18.64 106.92,18.64 106.19,19.38 106.19,23.44 99.86,29.77 97.91,29.77 96.56,31.11 v96.56,32.31 | IC4.120 88.6,38.44 89.2,38.44 89.49,38.15 89.49,33.68 v88.02,32.21
  Power 0.152: v96.56,32.31 96.45,32.42 94.59,32.42 94.31,32.7 88.51,32.7 v88.02,32.21
ENC_SW  (via drill 0.3)
  Top 0.152: IC4.173 75.19,60.53 75.19,56.5 75.91,55.78 75.91,54.99 v76.32,54.59 | v98.3,54.03 98.3,48.39 v98.59,48.09 | SW2.E 107.12,10.48 C3.2 106.66,14.8 105.82,15.63 105.82,23.3 99.71,29.41 97.76,29.41 95.93,31.24 95.93,40.28 v98.66,43.02
  Bottom 0.152: v98.66,43.02 98.66,48.03 v98.59,48.09 | v98.3,54.03 91.77,54.03 90.49,55.31 87.29,55.31 86.3,54.32 76.58,54.32 v76.32,54.59
EOUT_A
  Top 0.152: R9.2 R10.2 111.52,14.33 111.52,6.96 109.56,5 SW2.B
EOUT_B
  Top 0.152: R1.2 R5.2 102.5,14.79 SW2.A
ETH_COL  (via drill 0.3)
  Top 0.254: v52.06,40.84 52.06,41.69 54.54,44.17 56.32,44.17 56.86,43.62 57.58,43.62 IC4.47 | RN2.2 29.01,33.99 v29.04,34.02
  Power 0.254: v35.26,38.47 34.69,38.47 30.24,34.02 v29.04,34.02
  Bottom 0.254: v35.26,38.47 41.14,38.47 41.95,39.28 45.6,39.28 46.47,40.16 51.38,40.16 v52.06,40.84
ETH_CRS  (via drill 0.3)
  Top 0.203: v20.73,29.15 20.57,29.15 JP9.1
  Top 0.254: IC4.40 58.32,49.63 57.65,49.63 v57.51,49.49 | RN1.4 24.48,32.52 24.52,32.49 26.2,32.49 v26.41,32.28
  Bottom 0.254: v57.51,49.49 54.96,46.94 51.8,46.94 51.27,47.46 41.75,47.46 40.55,46.27 29.68,46.27 28.29,44.87 28.29,40.01 26.41,38.12 v26.41,32.28 25.25,32.28 22.11,29.15 v20.73,29.15
ETH_MDC  (via drill 0.3)
  Top 0.203: IC16.31 15.58,36.22
  Top 0.254: v19.26,39.29 18.66,39.29 15.58,36.22 | IC4.33 60.55,52.35 v60.55,52.69
  Bottom 0.254: v60.55,52.69 60.46,52.6 50.26,52.6 49.61,53.25 31.25,53.25 20.1,42.1 19.97,41.97 19.26,41.26 v19.26,39.29
ETH_MDIO  (via drill 0.3)
  Top 0.203: R39.1 13.77,35.11 IC16.30
  Top 0.254: IC4.42 58.72,47.82 58.72,47.47 58.06,46.81 57.22,46.81 56.61,47.42 53.71,47.42 v53.33,47.8 | v19.99,40.44 19.09,40.44 IC16.30
  Bottom 0.254: v19.99,40.44 26.31,46.75 40.34,46.75 41.53,47.94 51.45,47.94 51.87,48.36 52.48,48.36 53.04,47.8 v53.33,47.8
ETH_RX_CLK  (via drill 0.3)
  Top 0.254: IC4.41 59.6,47.64 v59.64,47.64 | v32.45,30.84 32.37,30.84 24.07,30.84 RN1.2
  Power 0.254: v36.4,40.18 36.4,36.78 32.45,32.83 v32.45,30.84
  Bottom 0.254: v59.64,47.64 58.46,46.46 51.59,46.46 51.07,46.98 46.21,46.98 39.41,40.18 v36.4,40.18
ETH_RX_DV  (via drill 0.3)
  Top 0.254: IC4.53 57.26,39.06 55.07,39.06 v54.22,38.23 | v34.51,31.47 34.41,31.57 24.14,31.57 RN1.3
  Power 0.254: v54.22,38.23 54.13,38.32 50.51,38.32 43.67,31.47 v34.51,31.47
ETH_RX_ER  (via drill 0.3)
  Top 0.203: RN2.1 27.67,33.09 v28.06,33.06
  Top 0.254: 23.88,28.38 25.05,28.38 v25.15,28.49 | JP12.1 23.84,28.35 23.88,28.38 | 27.7,33.05 v28.06,33.06 | 23.88,28.38 21.89,28.38 JP10.1
  Bottom 0.254: v25.15,28.49 28.06,31.39 v28.06,33.06
ETH_RX_ERR  (via drill 0.3)
  Top 0.152: IC4.79 68.37,31.79 66.36,31.79 64.57,30 61.43,30 60.1,31.33 40.61,31.33 v39.73,32.21 | JP12.2 24.8,27.18 27.8,30.19 34.33,30.19 36.03,31.89 v36.03,32.21
  Bottom 0.152: v39.73,32.21 v36.03,32.21
ETH_RXD0  (via drill 0.3)
  Top 0.254: v34.55,36.69 34.55,35.64 34.02,35.1 27.8,35.1 27.59,34.89 RN2.3 | IC4.54 57.48,38.58 56.04,38.58 v54.84,37.39
  Bottom 0.254: v34.55,36.69 34.57,36.66 54.12,36.66 v54.84,37.39
ETH_RXD1  (via drill 0.3)
  Top 0.254: IC4.55 60.92,41.34 57.67,38.1 56.57,38.1 v55.86,37.39 | v33.82,36.01 33.57,35.75 27.09,35.75 RN2.4
  Bottom 0.254: v55.86,37.39 54.65,36.18 35.04,36.18 34.8,35.94 33.89,35.94 v33.82,36.01
ETH_RXD2  (via drill 0.3)
  Top 0.254: v30.47,37.62 30.46,37.63 30.03,37.63 29.26,38.4 RN3.1 | IC4.83 71.43,32.02 71.43,32.54 v71.36,32.6
  Bottom 0.254: v30.47,37.62 30.7,37.39 30.7,36.21 32.49,34.42 64.52,34.42 65.98,32.96 70.29,32.96 70.64,32.6 v71.36,32.6
ETH_RXD3  (via drill 0.3)
  Top 0.254: v30,38.67 29.7,38.67 29.07,39.3 RN3.2 | IC4.84 72.03,31.91 v72.14,31.91
  Bottom 0.152: v72.14,31.91 72.09,31.86
  Bottom 0.254: v30,38.67 29.76,38.43 29.76,36.46 32.29,33.93 64.34,33.93 65.79,32.49 70.1,32.49 70.72,31.86 72.09,31.86
ETH_TX_CLK  (via drill 0.3)
  Top 0.254: IC4.35 61.38,50.1 v61.79,50.1 | v28.53,49.53 28.53,46.13 v28.45,46.05 | RN3.3 27.52,40.2 v27.52,40.21
  Bottom 0.254: v61.79,50.1 59.77,52.12 50.05,52.12 49.41,52.77 31.45,52.77 28.53,49.85 v28.53,49.53 | v28.45,46.05 27.77,45.36 27.77,40.45 v27.52,40.21
ETH_TX_EN  (via drill 0.3)
  Top 0.254: v70.79,33.41 70.7,33.41 IC4.80 | RN3.4 27.97,41.1 28.97,40.1 29.48,39.59 29.7,39.37 v30.79,39.37
  Bottom 0.254: v30.79,39.37 30.79,38.32 31.18,37.92 31.18,36.41 32.69,34.9 64.74,34.9 66.22,33.41 v70.79,33.41
ETH_TXD0  (via drill 0.3)
  Top 0.254: v29.49,41.47 29.48,41.45 28.58,41.45 27.9,42.13 RN4.1 | IC4.85 70.95,30.12 70.49,30.12 v70.29,30.33
  Bottom 0.254: v29.49,41.47 29.27,41.24 29.27,36.26 32.07,33.45 59.1,33.45 61.17,31.38 69.63,31.38 70.29,30.72 v70.29,30.33
ETH_TXD1  (via drill 0.3)
  Top 0.254: v29.01,42.34 28.32,43.03 RN4.2 | IC4.86 71.16,29.63 70.01,29.63 v69.82,29.44
  Bottom 0.254: v29.01,42.34 28.78,42.11 28.78,36.04 31.86,32.97 58.89,32.97 60.96,30.9 68.01,30.9 69.47,29.44 v69.82,29.44
ETH_TXD2  (via drill 0.3)
  Top 0.254: IC4.34 59.62,52.57 v59.62,53.3 | RN4.3 27.44,43.94 27.7,44.2 27.7,51.56 v29.86,53.72
  Bottom 0.254: v59.62,53.3 59.4,53.09 50.46,53.09 49.32,54.23 30.37,54.23 v29.86,53.72
ETH_TXD3  (via drill 0.3)
  Top 0.254: v29.81,54.66 27.09,51.94 27.09,44.87 27.06,44.84 RN4.4 26.8,44.82 | v77.51,58.33 77.51,58.61 IC4.167
  Bottom 0.254: v29.81,54.66 30.42,55.27 49.2,55.27 51.36,57.43 60.15,57.43 60.22,57.37 60.23,57.37 60.35,57.24 66.96,57.24 68.08,58.36 77.49,58.36 v77.51,58.33
FMC_A0
  Top 0.254: IC7.23 43.49,54.89 41.47,56.91 41.47,59.6 44.98,63.11 63.64,63.11 64.98,61.77 64.98,59.94 IC4.16
FMC_A1
  Top 0.254: IC4.17 64.5,59.72 64.5,61.61 63.45,62.65 45.2,62.65 41.97,59.41 41.97,57.1 43.38,55.69 IC7.24
FMC_A2
  Top 0.254: IC4.18 64.01,59.49 64.01,61.44 63.26,62.19 45.43,62.19 42.46,59.22 42.46,57.29 43.26,56.49 IC7.25
FMC_A3
  Top 0.254: IC4.19 63.53,59.27 63.53,61.28 63.07,61.73 45.66,61.73 42.94,59.02 42.94,57.68 43.34,57.29 IC7.26
FMC_A4  (via drill 0.3)
  Top 0.254: IC4.20 63.58,58.51 v63.21,58.51 | IC7.29 38.14,57.29 v38.16,57.28
  Bottom 0.254: v63.21,58.51 63.06,58.66 62.13,58.66 61.92,58.45 51.01,58.45 49.52,56.96 39.25,56.96 38.93,57.28 v38.16,57.28
FMC_A5  (via drill 0.3)
  Top 0.254: IC4.21 63.59,57.8 62.58,57.8 v62.42,57.95 | IC7.30 38.71,56.49 v38.73,56.48
  Bottom 0.254: v62.42,57.95 51.2,57.95 49.73,56.48 v38.73,56.48
FMC_A6
  Top 0.254: IC7.31 35.62,55.69 42.03,49.28 42.03,37.81 43.16,36.68 43.98,36.68 45.27,36.68 57.48,36.68 58.78,37.97 61.12,37.97 IC4.60
FMC_A7
  Top 0.254: IC4.63 62.42,37.16 62.42,36.46 62.16,36.2 42.96,36.2 41.53,37.62 41.53,49.09 35.73,54.89 IC7.32
FMC_A8
  Top 0.254: IC4.64 62.92,36.95 62.92,36.28 62.35,35.71 42.75,35.71 42.7,35.76 42.6,35.87 41.05,37.41 41.05,48.87 35.84,54.08 33.11,54.08 IC7.33
FMC_A9
  Top 0.254: IC4.65 63.41,36.73 63.41,36.09 62.55,35.23 42.55,35.23 42.5,35.28 42.17,35.61 40.57,37.21 40.57,48.65 35.93,53.29 IC7.34
FMC_A10  (via drill 0.3)
  Top 0.254: IC4.66 63.9,36.51 63.9,35.89 62.76,34.75 42.33,34.75 40.06,37.02 40.06,48.13 v39.67,48.53 | v42.87,51.65 42.87,53.48 43.48,54.09 IC7.22
  Bottom 0.254: v39.67,48.53 40,48.53 42.87,51.4 v42.87,51.65
FMC_A11
  Top 0.254: IC4.67 64.38,36.29 64.38,35.69 62.96,34.27 42.12,34.27 42.08,34.3 41.51,34.87 39.58,36.8 39.58,47.61 38.95,48.23 38.95,49.58 36.05,52.49 IC7.35
FMC_BA0  (via drill 0.3)
  Top 0.254: IC7.20 45.1,52.49 47.54,54.93 v53.42,54.93 | IC4.112 78.83,42.55 78.83,45.97 v78.38,46.43
  Bottom 0.254: v53.42,54.93 53.89,54.93 55.25,53.57 58.88,53.57 59.33,54.01 62.25,54.01 65.73,50.53 74.6,50.53 78.38,46.76 v78.38,46.43
FMC_BA1  (via drill 0.3)
  Top 0.254: IC7.21 44.17,53.35 45.25,53.35 47.31,55.41 52.57,55.41 v52.8,55.64 | IC4.113 79.29,42.8 v79.29,46.49
  Bottom 0.254: v52.8,55.64 53.87,55.64 55.45,54.05 58.68,54.05 59.12,54.5 62.42,54.5 62.96,53.96 62.96,53.95 65.89,51.02 74.77,51.02 v79.29,46.49
FMC_D0  (via drill 0.3)
  Top 0.254: IC7.2 v43.02,38.09 | IC4.97 77.39,33.39 77.39,37.62 v77.06,37.95
  Bottom 0.254: v43.02,38.09 50.05,38.09 50.92,38.95 63.33,38.95 63.82,38.46 70.39,38.46 70.9,37.95 v77.06,37.95
FMC_D1  (via drill 0.3)
  Top 0.254: IC7.4 48.82,39.69 v49.23,39.28 | IC4.98 77.84,33.64 77.84,38.14 77.12,38.86 v77.06,38.86
  Bottom 0.254: v77.06,38.86 76.94,38.86 76.5,38.42 71.09,38.42 70.56,38.94 64.03,38.94 63.53,39.43 49.38,39.43 v49.23,39.28
FMC_D2  (via drill 0.3)
  Top 0.152: v80.69,44.11
  Top 0.254: IC7.5 45.23,40.49 v45.23,40.45 | v80.69,44.11 IC4.142
  Bottom 0.254: v45.23,40.45 46.08,40.45 46.27,40.64 50.84,40.64 51.76,41.55 55.45,41.55 56.21,40.79 64.97,40.79 65.88,41.71 78.29,41.71 v80.69,44.11
FMC_D3  (via drill 0.3)
  Top 0.254: IC7.7 44.96,42.09 v45.84,41.21 | IC4.143 80.89,45.02 v80.62,45.02
  Bottom 0.254: v45.84,41.21 45.93,41.12 50.64,41.12 51.55,42.04 55.66,42.04 56.42,41.27 64.8,41.27 65.7,42.18 78.1,42.18 80,44.08 80,44.4 v80.62,45.02
FMC_D4  (via drill 0.3)
  Top 0.254: IC7.8 44.86,42.89 45.84,41.91 46.54,41.91 v46.6,41.85 | IC4.68 66.07,37.27 66.07,43.04 65.37,43.74 v65.37,43.87
  Bottom 0.254: v46.6,41.85 48.84,41.85 50.59,43.6 65.1,43.6 v65.37,43.87
FMC_D5  (via drill 0.3)
  Top 0.254: IC7.10 45.24,44.49 45.65,44.9 v46.03,44.9 | IC4.69 66.55,37.04 66.55,43.26 66.08,43.73 66.08,44.49 v65.84,44.73
  Bottom 0.254: v65.84,44.73 65.1,44.73 64.46,44.08 50.38,44.08 49.27,42.96 47.96,42.96 v46.03,44.9
FMC_D6  (via drill 0.3)
  Top 0.254: IC7.11 45.28,45.29 45.65,45.66 46.74,45.66 v46.79,45.61 | IC4.70 67.05,36.83 67.05,43.46 66.56,43.94 66.56,45.31 v66.34,45.54
  Bottom 0.254: v66.34,45.54 65.23,45.54 64.25,44.56 47.76,44.56 46.79,45.53 v46.79,45.61
FMC_D7  (via drill 0.3)
  Top 0.254: IC7.13 44.94,46.89 45.5,46.33 47.08,46.33 47.72,45.7 v47.72,45.62 | IC4.73 68.32,35.98 68.32,36.65 67.53,37.44 67.53,43.67 67.05,44.16 v67.05,46.3
  Bottom 0.254: v67.05,46.3 65.3,46.3 64.04,45.05 48.29,45.05 v47.72,45.62
FMC_D8
  Top 0.254: IC7.42 36.68,46.89 39.09,44.48 39.09,36.6 41.91,33.78 61.09,33.78 62.44,32.44 63.66,32.44 65.37,34.15 67.19,34.15 IC4.74
FMC_D9
  Top 0.254: IC7.44 36.23,45.29 38.61,42.9 38.61,36.39 41.7,33.3 60.89,33.3 62.23,31.95 63.86,31.95 65.57,33.67 67.42,33.67 IC4.75
FMC_D10
  Top 0.254: IC7.45 35.95,44.49 38.13,42.3 38.13,36.2 41.51,32.82 60.69,32.82 62.03,31.47 64.06,31.47 65.78,33.19 67.64,33.19 IC4.76
FMC_D11
  Top 0.254: IC7.47 36.12,42.89 37.65,41.36 37.65,35.99 41.3,32.33 60.48,32.33 61.83,30.99 64.27,30.99 65.98,32.7 67.87,32.7 IC4.77
FMC_D12
  Top 0.254: IC7.48 35.73,42.09 37.16,40.65 37.16,35.79 41.1,31.85 60.27,31.85 61.62,30.49 64.46,30.49 66.18,32.22 68.09,32.22 IC4.78
FMC_D13
  Top 0.254: IC7.50 34.97,40.49 36.68,38.77 36.68,35.59 39.02,33.25 39.02,31.89 40.1,30.81 59.92,30.81 61.22,29.52 63.1,29.52 65.41,27.2 74.15,27.2 75.95,29.01 75.95,29.17 IC4.89
FMC_D14
  Top 0.254: IC7.51 35.07,39.69 36.2,38.56 36.2,35.37 38.52,33.05 38.52,31.69 39.88,30.33 59.72,30.33 61.02,29.03 62.9,29.03 65.21,26.72 74.34,26.72 76.56,28.94 76.56,29.27 IC4.90
FMC_D15
  Top 0.254: IC7.53 34.59,38.09 35.72,36.96 35.72,35.15 38.04,32.83 38.04,31.47 39.68,29.83 59.53,29.83 60.81,28.55 62.69,28.55 65,26.24 74.54,26.24 77.06,28.75 77.06,29.48 IC4.91
FMC_NBL0  (via drill 0.3, 0.3 pad 0.3)
  Top 0.254: IC4.169 77.18,59.69 76.36,59.69 v75.89,59.22 | IC7.15 43.23,48.49 43.08,48.64 43.08,49.71 40.42,52.38 40.42,59.54 v40.25,59.7
  Bottom 0.254: v75.89,59.22 75.77,59.22 75.07,59.92 40.47,59.92 v40.25,59.7
FMC_NBL1  (via drill 0.3)
  Top 0.254: IC4.170 76.95,60.17 v75.82,60.17 | IC7.39 32.01,49.29 31.78,49.52 v31.78,56.41
  Bottom 0.254: v31.78,56.41 35.26,56.41 39.27,60.43 75.57,60.43 v75.82,60.17
FMC_SDCKE0  (via drill 0.3)
  Top 0.254: IC4.43 56.81,49.02 53.55,49.02 v53.27,48.74 | IC7.37 35.25,50.89 v38.17,47.97
  Bottom 0.254: v53.27,48.74 53.27,49.19 52.56,49.9 42.05,49.9 39.98,47.83 38.31,47.83 v38.17,47.97
FMC_SDCLK  (via drill 0.3)
  Top 0.203: IC7.38 34.2,50.09 v34.22,50.1
  Top 0.254: IC4.116 83.94,40.27 v82.85,40.27
  Power 0.254: v34.22,50.1 40.59,43.73 46.63,43.73 50.6,39.75 52.77,39.75 v53.17,40.15
  Bottom 0.203: v53.17,40.15 53.29,39.99 55.62,39.99 55.96,40.34 77.02,40.34 77.35,40.01 82.61,40.01 82.85,40.25 v82.85,40.27
FMC_SDNCAS  (via drill 0.3)
  Top 0.254: IC7.17 43.4,50.09 40.94,52.55 40.94,60.44 v41.62,61.12 | IC4.160 81.08,57.25 v80.23,56.4
  Bottom 0.254: v80.23,56.4 80.23,57.54 76.86,60.91 41.84,60.91 v41.62,61.12
FMC_SDNE0  (via drill 0.3)
  Top 0.254: IC7.19 45.51,51.69 v45.9,51.3 46.3,51.69 R23.2 | IC4.44 56.86,48.26 54.22,48.26 v54.17,48.31
  Bottom 0.254: v54.17,48.31 54.17,48.97 52.76,50.38 46.82,50.38 v45.9,51.3
FMC_SDNRAS  (via drill 0.3)
  Top 0.254: IC7.18 45.12,50.89 45.43,50.57 48.87,50.57 49.71,49.73 49.71,47.5 50.77,46.44 v50.77,46.27 | IC4.59 63.5,41.07 63.5,42.74 62.56,43.67 v62.56,46.2
  Bottom 0.254: v50.77,46.27 51.06,45.97 62.34,45.97 v62.56,46.2
FMC_SDNWE
  Top 0.254: IC4.46 58.55,45.31 58.55,45.52 58.16,45.91 51.39,45.91 51.06,45.58 50.42,45.58 50.04,45.96 50.04,46.48 49.23,47.3 49.23,49.53 48.68,50.08 45.74,50.08 44.95,49.29 IC7.16
FRM2
  cutout Gnd: 136.77,63.02 134.49,63.02 134.49,68.36 136.77,68.36
  cutout Top: 136.77,63.02 134.49,63.02 134.49,68.36 136.77,68.36
FRM3
  cutout Power: 136.77,63.02 134.49,63.02 134.49,68.36 136.77,68.36
GND  (via drill 0.3, 0.4)
  Top 0.152: v93.79,15.35 94.56,15.35 C49.- | v93.6,12.05 IC9.2 | v113.02,13.84 C7.2 | C6.1 v104.49,13.86 | v107.12,17.65 C3.1 | v34.09,58.24 33.08,58.11 IC7.28 | v70.88,17.64 IC13.3 | v86.54,57.85 86.4,57.71 C30.2 | v100.19,46.38 99.99,46.58 C22.- | C59.1 98.24,35.38 v98.19,35.33 | C54.2 101.92,31.45 v101.98,31.51 | v104.79,34.56 104.84,34.62 IC12.TP | C8.1 40.96,23.71 v40.95,23.72 | IC15.3 | v57.85,2.02 58.83,1.93 C39.2 | v121.15,8.45 C4.1 | v76.11,22.02 JP7.NC | IC8.7 114.17,46.87 v114.09,46.88 | IC8.1 IC8.2 IC8.3 107.6,45.57 107.6,44.3 v107.6,43.76 | v88.09,59.6 88.86,59.6 R18.1 | IC6.3 100,65.42 v99.98,65.39 | v98.94,68.29 99.79,68.29 C38.2 | C23.2 86.22,34.86 v86.24,34.85
  Top 0.203: C66.2 v8.54,44.46 | C69.2 v8.56,42.38 | C68.2 v8.56,40.66 | C67.- 6.86,38.7 v6.85,38.68 | v21.07,45.63 21.07,46.43 C63.2 | v11.51,45.62 11.62,46.37 C61.2 | IC16.19 14.75,41.53 | v21.33,38.51 IC16.47 | v27.77,37.1 26.89,37.09 C71.2 | v24.48,26.06 23.54,25.64 R42.1 | IC4.117 84.81,40.1 v84.81,40.82 | R45.1 v16.69,25.65 | v7.03,36.6 R55.1 | 107.6,44.3 IC8.4
  Top 0.229: v80.83,9.61 80.83,10.02 IC11.3 | v83.19,7.01 82.81,7.01 J2.5 | IC14.13 82.02,19.27 v81.77,19.02
  Top 0.254: IC1.3 30.46,20.11 v30.54,20.07 | v25.14,24.07 IC2.2 | ZD1.A 40.58,15.61 v40.9,15.48 | v42.92,41.27 44.09,41.27 IC7.6 | IC7.46 32,43.69 v31.93,43.62 | IC7.54 33.08,37.27 31.95,37.27 v31.95,37.27 | v31.93,38.86 33.07,38.86 IC7.52 | IC7.12 44.05,46.04 v42.87,46.04 | LCD1.29 65.93,14.44 v65.9,14.41 | C56.1 v74.11,21.35 | IC4.61 63.72,39.87 64.15,39.87 v64.37,39.65 | C20.2 v58.95,37.11 | v59.71,56.67 58.79,56.67 C9.1 | v52.94,56.67 53.9,56.67 C11.1 | C35.2 51.58,52.35 C34.2 51.31,53.77 v51.29,53.8 | v56.94,51.41 56.7,52.16 C18.2 | IC4.37 60.89,49.18 v60.89,49.15 | C70.2 v16.45,30.63 | IC16.35 16.55,34.32 17.39,35.17 v17.73,35.17 17.73,34.83 IC16.36 | v28.15,57.61 30.01,57.99 D1.A | v15.17,63.56 15.18,62.97 C14.2 | v12.16,55.03 12.16,53.98 IC5.1 | C15.- 18.15,53.45 v17.85,53.76 | v20.1,22.61 C60.2 | v24.03,21.2 23.16,21.2 C62.1 | C64.1 10.16,21.59 v10.15,22.05 | v15.18,44.37 15.18,43.95 IC16.15 | v17.73,29.73 17.73,30.58 C65.2 | 14.75,41.53 15.49,40.79 v15.49,40.01 | v61.51,55.23 61.51,55.93 C17.2 | v65.85,61.85 66.4,61.86 C16.2 | v87.05,35.53 C24.2 | C28.2 v94.8,44.2 | v95.37,42.33 C36.2 | v88.95,47.37 88.95,47.42 IC4.135 | v94.45,49.24 C29.2 | C2.2 30.22,23.18 v30.15,23.11 | v40.91,18.4 40.09,18.09 ZD2.A | LCD1.3 52.93,14.56 v53.14,14.35 | IC7.41 v34.34,47.69 | C58.1 v82.95,24.56 | C57.1 v82.35,22.72 | v54.02,40.66 54.11,41.39 R12.1 | v66.28,54.76 65.91,54.76 IC4.22 | v67.61,36.36 67.28,36.36 IC4.71 | v55.3,40.69 56.01,40.69 C19.2 | IC4.14 68.61,57.73 68.61,57.23 v68.43,57.05 | v81.26,37.69 81.57,37.69 IC4.109 | IC4.103 79.75,35.27 79.75,35.62 v79.92,35.8 | v88.18,6.38 89.22,6.38 Q1.E | C13.2 11.1,67.12 v11.19,67.03 | IC4.148 84.33,51.99 83.95,51.99 v82.75,50.79
  Top 0.254: IC4.95 78.49,30.87 v78.66,30.87 | C27.2 82.01,31.03 v82.72,31.03 | v89.28,45.31 89.28,44.83 IC4.130 | v63.02,33.12 C21.2 | v53.99,20.45 52.92,20.13 C50.2 | C48.2 50.52,20.75 v50.18,21.09 | v52.39,22.31 R26.2 | IC4.158 80.99,55.73 v80.99,55.69 | IC15.3 v14.96,20.6 | v111.81,49.1 111.81,49.92 C40.1 | IC14.13 IC14.14 | IC14.6 78.93,17.97 v79.04,17.93 | v86.21,11.19 85.37,11.19 C52.1 | v53.46,8.45 JP6.NC | C51.2 77.53,14.81 v77.51,14.82 | v20.35,58.34 21.45,58.34 C1.2 | R13.1 79.89,64.87 79.57,65.19 C31.2 77.72,65.1 76.61,63.99 v76.61,63.44
  Top 0.305: v65.7,27.91 65.7,28.55 C37.2 | v67.81,27.93 67.81,28.35 C26.2
  Top 0.356: IC10.2 48.01,24.12
  Top 0.406: v36.71,22.66 IC3.6 | C5.2 v33.52,24.89 | C41.2 v47.74,37.38 | v48.75,43.67 C42.2 | v47.72,48.68 C43.2 | C44.2 v48.57,58.1 | C45.2 v30.74,48.74 | v30.75,44.26 C46.2 | C32.2 89.44,53.81 89.4,53.85 v89.39,54.59 89.4,55.15 C33.2 | IC12.7 110.13,35.33 v110.14,35.19 | 48.01,24.12 v47.98,24.14 | v43.83,27.5 43.83,26.76 C47.2 | C53.1 109.8,31.79 v110.13,32.12 | v70.77,64.34 C12.2 C10.2 72.31,66.95 C25.2 | JP1.1 v20.57,55.73
  Bottom 0.254: J1.6 v64.45,2.95 v64.46,2.96 | J1.S 55.2,3.89 v55.25,3.94
  other vias: 93.79,14.59 43.03,27.5 90.07,54.58 100.19,47.08 62.63,14.43 40.91,19.09 40.9,16.18 105.66,35.45 105.66,34.56 104.79,35.45 109.43,32.12 28.15,58.31 9.75,67.03 12.86,55.03 11.46,55.03 17.85,53.06 57.85,2.63 49.86,41.85 72.39,41.02 72.41,42.86 72.74,39.32 86.21,46.57 86.22,44.55 50.87,21.09 83.19,7.7 115.61,29.74 111.45,54.15 106.3,54.41 76.81,14.82 20.35,59.04 20.35,57.65
  pour Gnd (isolate 0.203, rank 2): 0.05,69.85 139.31,69.85 139.31,0.25 48.19,-0.13 48.19,11.18 39.65,11.2 39.65,7.39 36.88,7.39 36.88,11.18 28.12,11.18 28.12,-0.13 0.05,-0.13
  pour Bottom (isolate 0.203, rank 2): 0.44,70.36 139.12,70.36 139.12,-0.25 48.19,-0.25 48.19,11.18 39.68,11.18 39.68,7.37 36.88,7.37 36.88,11.18 28.12,11.18 28.12,-0.25 0.44,-0.25
HOLE_MCU1  (via drill 3.2 pad 5.5)
  other vias: 3,66.5
HOLE_MCU2  (via drill 3.2 pad 5.5)
  other vias: 122,66.5
HOLE_MCU3  (via drill 3.2 pad 5.5)
  other vias: 3,3.5
HOLE_MCU4  (via drill 3.2 pad 5.5)
  other vias: 122,3.5
I2C1_SCL  (via drill 0.3)
  Top 0.152: X2.13 36.17,62.63 36.17,64.59 40.33,68.75 78.52,68.75 81.69,65.57 83.16,65.57 v83.44,65.85 | IC4.164 81.5,60.48 82.06,60.48 82.78,61.2 v84.36,61.2 84.36,61.64 R15.2 83.84,62.16 | v108.56,59.51 115.24,52.83 115.24,45.61 | v116.09,33.21 115.82,33.49 115.82,42.52 115.24,43.09 115.24,45.61 | IC8.6 115.24,45.6 115.24,45.61 | IC14.12 86.06,18.62 v86.08,18.64
  Power 0.152: v95.03,18.78 86.22,18.78 v86.08,18.64
  Bottom 0.152: X1.12 126.64,31.94 125.37,33.21 v116.09,33.21 112.12,29.23 97.02,29.23 94.73,26.95 94.73,19.07 v95.03,18.78 | v108.56,59.51 108.3,59.78 89.95,59.78 88.9,60.82 84.74,60.82 v84.36,61.2 83.44,62.12 v83.44,65.85
I2C1_SDA  (via drill 0.3)  (1 unrouted)
  Top 0.152: X2.14 34.87,63.83 40.14,69.1 78.68,69.1 81.58,66.2 v82,66.2 | IC4.165 81.47,61.15 v81.82,61.15 81.86,61.19 R16.2 | 115.62,44.31 115.62,53.02 109.54,59.11 v109.54,59.44 | v116.04,44.31 115.62,44.31 | v114.6,44.31 112.99,44.31 IC8.5 | v116.48,34.54 116.2,34.76 116.2,42.67 115.62,43.24 115.62,44.31 | IC14.11 v85.43,17.97 85.41,17.97
  Power 0.152: v94.35,18.15 94.35,18.16 94.09,18.43 86.77,18.43 86.31,17.97 v85.43,17.97
  Bottom 0.152: v114.6,44.31 v116.04,44.31 | X1.14 116.54,34.48 v116.48,34.54 115.45,33.52 115.45,33.08 111.95,29.59 96.87,29.59 94.38,27.1 94.38,17.92 v94.35,18.15 | v109.54,59.44 108.98,58.88 108.28,58.88 107.76,59.4 89.78,59.4 88.74,60.44 84.22,60.44 83.08,61.58 | 83.08,61.58 83.08,65.13 v82,66.2 | 81.83,61.14 82.28,61.58 83.08,61.58
IRQ_TOUCH  (via drill 0.3)
  Top 0.152: IC4.151 80.57,50.36 v80.57,50.32 | IC14.10 81.5,17.32 v81.39,17.44
  Bottom 0.152: v80.57,50.32 80.57,49.59 83.98,46.19 83.98,44.54 87.04,41.48 87.04,39.5 88.65,37.88 88.65,24.37 81.72,17.44 v81.39,17.44
LCD_DISP
  Top 0.152: LCD1.31 66.93,16.58 66.93,22.73 R31.1
LED_ACT  (via drill 0.3)
  Top 0.203: IC16.26 13.33,37.5 10.98,35.14 9.22,35.14 v7.9,33.82 7.9,32.76 R43.2 | R51.2 v7.89,29.4 v7.9,29.41
  Bottom 0.203: v7.9,29.41 v7.9,33.82
LED_LINK  (via drill 0.3)
  Top 0.203: IC16.28 11.4,34.15 v11.4,33.71 11.4,33.13 R50.2 | v5.91,24.96 R52.2
  Bottom 0.203: v5.91,24.96 5.95,24.96 8.89,27.9 8.89,31.15 11.4,33.66 v11.4,33.71
LED_SPEED  (via drill 0.3 pad 0.2)
  Top 0.152: 9.81,33.27 9.83,33.3
  Top 0.203: R48.2 9.81,33.27 | IC16.27 10.22,33.68 v9.83,33.68 | SPEED.C 5.94,33.78 v5.91,33.81
  Top 0.254: 9.83,33.3 v9.83,33.68
  Bottom 0.203: v9.83,33.68 8.8,34.71 6.81,34.71 v5.91,33.81
LTDC_B2  (via drill 0.3)
  Top 0.152: v75.95,33.31 75.68,33.58 75.68,45.48 78.96,48.76 79.92,48.76 81.67,50.49 81.67,50.74 IC4.150 | LCD1.23 62.92,18.41 61.59,19.75 v61.24,19.75